# Altium project 724452_RPL-HX_Mobile_AEP_Rev0p91.PrjPcb (part 5 of 13)

## Sheet 0030_DEBUG_CARD_SPI_SIG.SchDoc
size A3
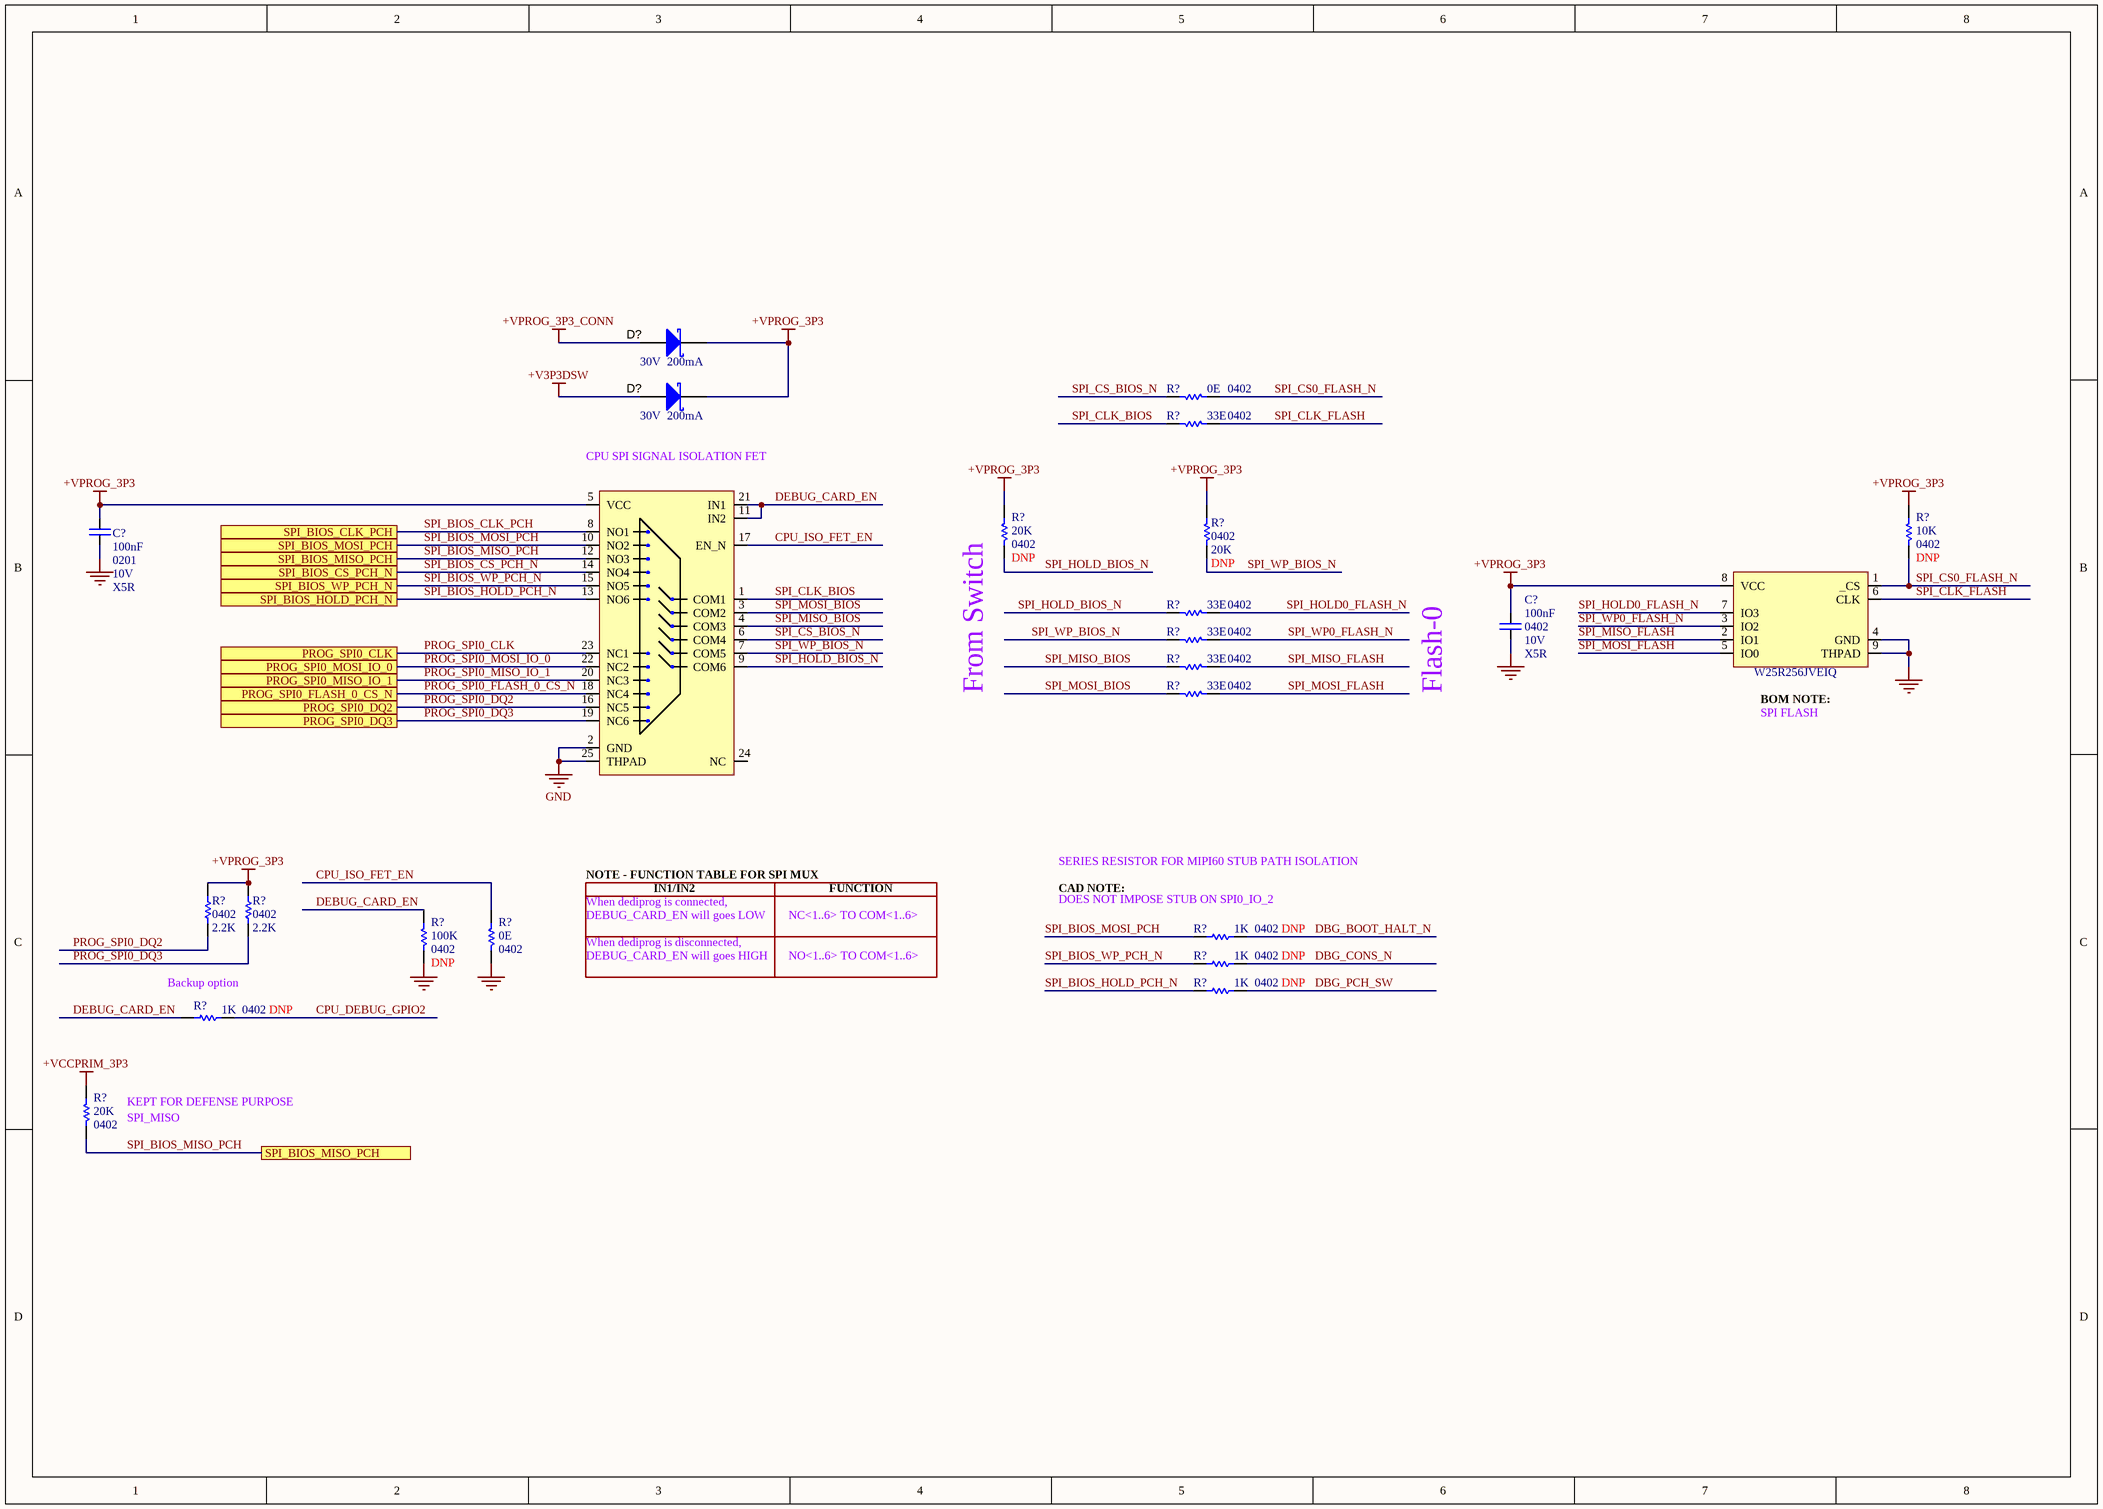
[diagram p52: 0030_DEBUG_CARD_SPI_SIG.SchDoc]

### Parts
(Parts that share a designator on the sheet are numbered #1, #2 ... from top to bottom, then left to right.)
C?#94  value 100nF  Case/Package: 0201  Voltage: 10V  Dielectric: X5R  [CAPC0201]
C?#95  value 100nF  Case/Package: 0402  Voltage: 10V  Dielectric: X5R  [CAPC0402]
D?#1  Current: 200mA  Voltage: 30V  (hidden comment: SCHOTTKY)
D?#2  Current: 200mA  Voltage: 30V  (hidden comment: SCHOTTKY)
EU?#1  C_TS3A27518E  (value not drawn)
EU?#2  Manufacturer Part Number: W25R256JVEIQ  (hidden comment: W25R256JV)
R?#73  value 0E  Case/Package: 0402  [RESC0402]  (hidden comment: Res)
R?#74  value 33E  Case/Package: 0402  [RESC0402]  (hidden comment: Res)
R?#75  value 20K  Case/Package: 0402  [RESC0402]  (hidden comment: Res)
R?#76  value 20K  Case/Package: 0402  [RESC0402]  (hidden comment: Res)
R?#77  value 10K  Case/Package: 0402  [RESC0402]  (hidden comment: Res)
R?#78  value 33E  Case/Package: 0402  [RESC0402]  (hidden comment: Res)
R?#79  value 33E  Case/Package: 0402  [RESC0402]  (hidden comment: Res)
R?#80  value 33E  Case/Package: 0402  [RESC0402]  (hidden comment: Res)
R?#81  value 33E  Case/Package: 0402  [RESC0402]  (hidden comment: Res)
R?#82  value 2.2K  Case/Package: 0402  [RESC0402]  (hidden comment: Res)
R?#83  value 2.2K  Case/Package: 0402  [RESC0402]  (hidden comment: Res)
R?#84  value 100K  Case/Package: 0402  [RESC0402]  (hidden comment: Res)
R?#85  value 0E  Case/Package: 0402  [RESC0402]  (hidden comment: Res)
R?#86  value 1K  Case/Package: 0402  [RESC0402]  (hidden comment: Res)
R?#87  value 1K  Case/Package: 0402  [RESC0402]  (hidden comment: Res)
R?#88  value 1K  Case/Package: 0402  [RESC0402]  (hidden comment: Res)
R?#89  value 1K  Case/Package: 0402  [RESC0402]  (hidden comment: Res)
R?#90  value 20K  Case/Package: 0402  [RESC0402]  (hidden comment: Res)

### Ports
PROG_SPI0_CLK, PROG_SPI0_DQ2, PROG_SPI0_DQ3, PROG_SPI0_FLASH_0_CS_N, PROG_SPI0_MISO_IO_1, PROG_SPI0_MOSI_IO_0, SPI_BIOS_CLK_PCH, SPI_BIOS_CS_PCH_N, SPI_BIOS_HOLD_PCH_N, SPI_BIOS_MISO_PCH, SPI_BIOS_MOSI_PCH, SPI_BIOS_WP_PCH_N

### Nets
+V3P3DSW: D?#2.A
+VCCPRIM_3P3: R?#90.2
+VPROG_3P3: C?#94.1 C?#95.1 D?#1.K D?#2.K EU?#1.5(VCC) EU?#2.8(VCC) R?#75.2 R?#76.2 R?#77.2 R?#82.2 R?#83.2
+VPROG_3P3_CONN: D?#1.A
GND: C?#94.2 C?#95.2 EU?#1.2(GND) EU?#1.25(THPAD) EU?#2.4(GND) EU?#2.9(THPAD) R?#84.1 R?#85.1  [project net EXP_A_RX_4_DP]
CPU_DEBUG_GPIO2: R?#89.1
CPU_ISO_FET_EN: EU?#1.17(EN_N) R?#85.2
DBG_BOOT_HALT_N: R?#86.1
DBG_CONS_N: R?#87.1
DBG_PCH_SW: R?#88.1
DEBUG_CARD_EN: EU?#1.11(IN2) EU?#1.21(IN1) R?#84.2 R?#89.2
PROG_SPI0_CLK: EU?#1.23(NC1) ; port PROG_SPI0_CLK
PROG_SPI0_DQ2: EU?#1.16(NC5) R?#82.1 ; port PROG_SPI0_DQ2
PROG_SPI0_DQ3: EU?#1.19(NC6) R?#83.1 ; port PROG_SPI0_DQ3
PROG_SPI0_FLASH_0_CS_N: EU?#1.18(NC4) ; port PROG_SPI0_FLASH_0_CS_N
PROG_SPI0_MISO_IO_1: EU?#1.20(NC3) ; port PROG_SPI0_MISO_IO_1
PROG_SPI0_MOSI_IO_0: EU?#1.22(NC2) ; port PROG_SPI0_MOSI_IO_0
SPI_BIOS_CLK_PCH: EU?#1.8(NO1) ; port SPI_BIOS_CLK_PCH
SPI_BIOS_CS_PCH_N: EU?#1.14(NO4) ; port SPI_BIOS_CS_PCH_N
SPI_BIOS_HOLD_PCH_N: EU?#1.13(NO6) R?#88.2 ; port SPI_BIOS_HOLD_PCH_N
SPI_BIOS_MISO_PCH: EU?#1.12(NO3) R?#90.1 ; port SPI_BIOS_MISO_PCH
SPI_BIOS_MOSI_PCH: EU?#1.10(NO2) R?#86.2 ; port SPI_BIOS_MOSI_PCH
SPI_BIOS_WP_PCH_N: EU?#1.15(NO5) R?#87.2 ; port SPI_BIOS_WP_PCH_N
SPI_CLK_BIOS: EU?#1.1(COM1) R?#74.1
SPI_CLK_FLASH: EU?#2.6(CLK) R?#74.2
SPI_CS0_FLASH_N: EU?#2.1(_CS) R?#73.2 R?#77.1
SPI_CS_BIOS_N: EU?#1.6(COM4) R?#73.1
SPI_HOLD0_FLASH_N: EU?#2.7(IO3) R?#78.2
SPI_HOLD_BIOS_N: EU?#1.9(COM6) R?#75.1 R?#78.1
SPI_MISO_BIOS: EU?#1.4(COM3) R?#80.1
SPI_MISO_FLASH: EU?#2.2(IO1) R?#80.2
SPI_MOSI_BIOS: EU?#1.3(COM2) R?#81.1
SPI_MOSI_FLASH: EU?#2.5(IO0) R?#81.2
SPI_WP0_FLASH_N: EU?#2.3(IO2) R?#79.2
SPI_WP_BIOS_N: EU?#1.7(COM5) R?#76.1 R?#79.1

Not connected (* = marked no-connect by the designer): EU?#1 24(NC)

### Notes on the sheet
- CPU SPI SIGNAL ISOLATION FET
- (near R?#75) From Switch
- Flash-0
- (near EU?#2) BOM NOTE:
- SPI FLASH
- DEBUG_CARD_EN will goes LOW
- When dediprog is connected,
- NOTE - FUNCTION TABLE FOR SPI MUX
- IN1/IN2
- NC<1..6> TO COM<1..6>
- FUNCTION
- CAD NOTE:
- (near R?#86) DOES NOT IMPOSE STUB ON SPI0_IO_2
- SERIES RESISTOR FOR MIPI60 STUB PATH ISOLATION
- (near R?#89) Backup option
- DEBUG_CARD_EN will goes HIGH
- When dediprog is disconnected,
- NO<1..6> TO COM<1..6>
- (near R?#90) KEPT FOR DEFENSE PURPOSE
- (near R?#90) SPI_MISO

### Library data of the parts
C?#94 = Cap: CAP CER 100nF 10V X5R 0201
C?#95 = Cap: CAP CER 100nF 10V X5R 0402
D?#1 D?#2 = SCHOTTKY: Diode, Schottky, 30V, 200mA,; ComponentLink1Description: Datasheet link; ComponentLink1URL: http://www.comchip.com.tw/cms/UserFiles/QW-BB012%20CDBC520-G%7E5100-G%20RevC809622.pdf; Manufacturer Part Number: *; Case/Package: *
EU?#1 = C_TS3A27518E: 6 Circuit IC Switch 2:1 6.2Ohm 24-WQFN (4x4); Manufacturer Part Number: TS3A27518ERTWR; Case/Package: 24-WFQFN
EU?#2 = W25R256JV: FLASH - NOR Memory IC 256Mb (32M x 8) SPI - Quad I/O 133 MHz 7 ns 8-WSON (8x6); Case/Package: 8-WSON
R?#73 R?#85 = Res: Thick Film Resistor -  0ohm, 1%, 0402
R?#74 R?#78-R?#81 = Res: Thick Film Resistor -  33ohm, 1%, 0402
R?#75 R?#76 R?#90 = Res: Thick Film Resistor -  20Kohm, 1%, 0402
  R?#75 R?#76: DNP: DNP
R?#77 = Res: Thick Film Resistor -  10Kohm, 1%, 0402; DNP: DNP
R?#82 R?#83 = Res: Thick Film Resistor -  2.2Kohm, 1%, 0402
R?#84 = Res: Thick Film Resistor -  100Kohm, 1%, 0402; DNP: DNP
R?#86-R?#89 = Res: Thick Film Resistor -  1Kohm, 1%, 0402; DNP: DNP

## Sheet 0031_DEBUG-XDP_SERIES_T.SchDoc
size A3
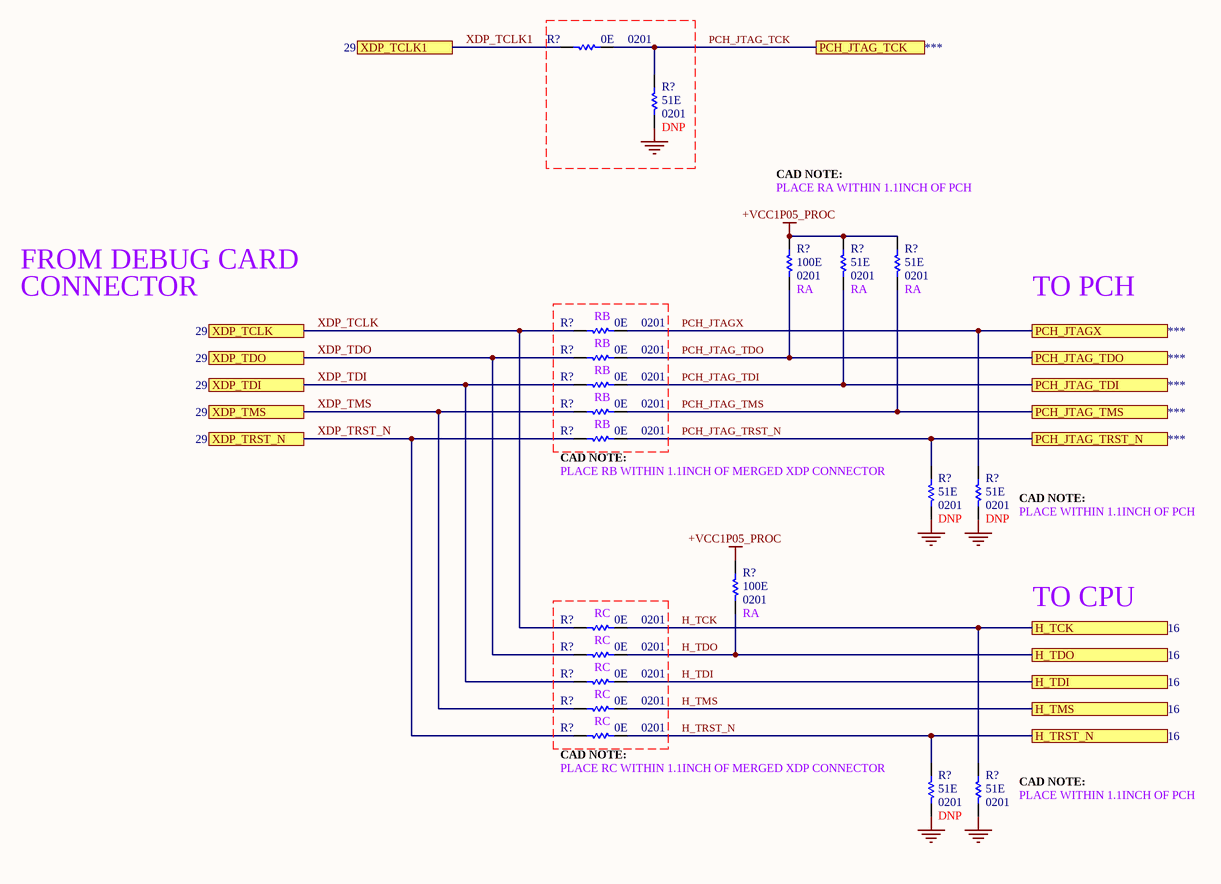
[diagram p53: 0031_DEBUG-XDP_SERIES_T.SchDoc]

### Parts
(Parts that share a designator on the sheet are numbered #1, #2 ... from top to bottom, then left to right.)
R?#91  value 0E  Case/Package: 0201  [RESC0201]  (hidden comment: Res)
R?#92  value 51E  Case/Package: 0201  [RESC0201]  (hidden comment: Res)
R?#93  value 100E  Case/Package: 0201  [RESC0201]  (hidden comment: Res)
R?#94  value 51E  Case/Package: 0201  [RESC0201]  (hidden comment: Res)
R?#95  value 51E  Case/Package: 0201  [RESC0201]  (hidden comment: Res)
R?#96  value 0E  Case/Package: 0201  [RESC0201]  (hidden comment: Res)
R?#97  value 0E  Case/Package: 0201  [RESC0201]  (hidden comment: Res)
R?#98  value 0E  Case/Package: 0201  [RESC0201]  (hidden comment: Res)
R?#99  value 0E  Case/Package: 0201  [RESC0201]  (hidden comment: Res)
R?#100  value 0E  Case/Package: 0201  [RESC0201]  (hidden comment: Res)
R?#101  value 51E  Case/Package: 0201  [RESC0201]  (hidden comment: Res)
R?#102  value 51E  Case/Package: 0201  [RESC0201]  (hidden comment: Res)
R?#103  value 100E  Case/Package: 0201  [RESC0201]  (hidden comment: Res)
R?#104  value 0E  Case/Package: 0201  [RESC0201]  (hidden comment: Res)
R?#105  value 0E  Case/Package: 0201  [RESC0201]  (hidden comment: Res)
R?#106  value 0E  Case/Package: 0201  [RESC0201]  (hidden comment: Res)
R?#107  value 0E  Case/Package: 0201  [RESC0201]  (hidden comment: Res)
R?#108  value 0E  Case/Package: 0201  [RESC0201]  (hidden comment: Res)
R?#109  value 51E  Case/Package: 0201  [RESC0201]  (hidden comment: Res)
R?#110  value 51E  Case/Package: 0201  [RESC0201]  (hidden comment: Res)

### Ports
H_TCK, H_TDI, H_TDO, H_TMS, H_TRST_N, PCH_JTAG_TCK, PCH_JTAG_TDI, PCH_JTAG_TDO, PCH_JTAG_TMS, PCH_JTAG_TRST_N, PCH_JTAGX, XDP_TCLK, XDP_TCLK1, XDP_TDI, XDP_TDO, XDP_TMS, XDP_TRST_N

### Nets
+VCC1P05_PROC: R?#93.2 R?#94.2 R?#95.2 R?#103.2
GND: R?#92.1 R?#101.1 R?#102.1 R?#109.1 R?#110.1  [project net EXP_A_RX_4_DP]
H_TCK: R?#104.2 R?#110.2 ; port H_TCK
H_TDI: R?#106.2 ; port H_TDI
H_TDO: R?#103.1 R?#105.2 ; port H_TDO
H_TMS: R?#107.2 ; port H_TMS
H_TRST_N: R?#108.2 R?#109.2 ; port H_TRST_N
PCH_JTAG_TCK: R?#91.2 R?#92.2 ; port PCH_JTAG_TCK
PCH_JTAG_TDI: R?#94.1 R?#98.2 ; port PCH_JTAG_TDI
PCH_JTAG_TDO: R?#93.1 R?#97.2 ; port PCH_JTAG_TDO
PCH_JTAG_TMS: R?#95.1 R?#99.2 ; port PCH_JTAG_TMS
PCH_JTAG_TRST_N: R?#100.2 R?#101.2 ; port PCH_JTAG_TRST_N
PCH_JTAGX: R?#96.2 R?#102.2 ; port PCH_JTAGX
XDP_TCLK: R?#96.1 R?#104.1 ; port XDP_TCLK
XDP_TCLK1: R?#91.1 ; port XDP_TCLK1
XDP_TDI: R?#98.1 R?#106.1 ; port XDP_TDI
XDP_TDO: R?#97.1 R?#105.1 ; port XDP_TDO
XDP_TMS: R?#99.1 R?#107.1 ; port XDP_TMS
XDP_TRST_N: R?#100.1 R?#108.1 ; port XDP_TRST_N

### Notes on the sheet
- CAD NOTE:
- PLACE RA WITHIN 1.1INCH OF PCH
- FROM DEBUG CARD
- CONNECTOR
- (near R?#96) RB
- (near R?#93) RA
- (near R?#94) RA
- (near R?#95) RA
- TO PCH
- (near R?#97) RB
- (near R?#98) RB
- (near R?#100) CAD NOTE:
- (near R?#100) PLACE RB WITHIN 1.1INCH OF MERGED XDP CONNECTOR
- (near R?#99) RB
- (near R?#102) CAD NOTE:
- (near R?#102) PLACE WITHIN 1.1INCH OF PCH
- (near R?#104) RC
- (near R?#103) RA
- TO CPU
- (near R?#105) RC
- (near R?#108) CAD NOTE:
- (near R?#106) RC
- (near R?#107) RC
- (near R?#108) PLACE RC WITHIN 1.1INCH OF MERGED XDP CONNECTOR
- (near R?#110) CAD NOTE:
- (near R?#110) PLACE WITHIN 1.1INCH OF PCH

### Library data of the parts
R?#91 R?#96-R?#100 R?#104-R?#108 = Res: Thick Film Resistor -  0ohm, 1%, 0201
R?#92 R?#94 R?#95 R?#101 R?#102 R?#109 R?#110 = Res: Thick Film Resistor -  51ohm, 1%, 0201
  R?#92 R?#101 R?#102 R?#109: DNP: DNP
R?#93 R?#103 = Res: Thick Film Resistor -  100ohm, 1%, 0201

## Sheet 0032_DEGUG-JTAG.SchDoc
size A3
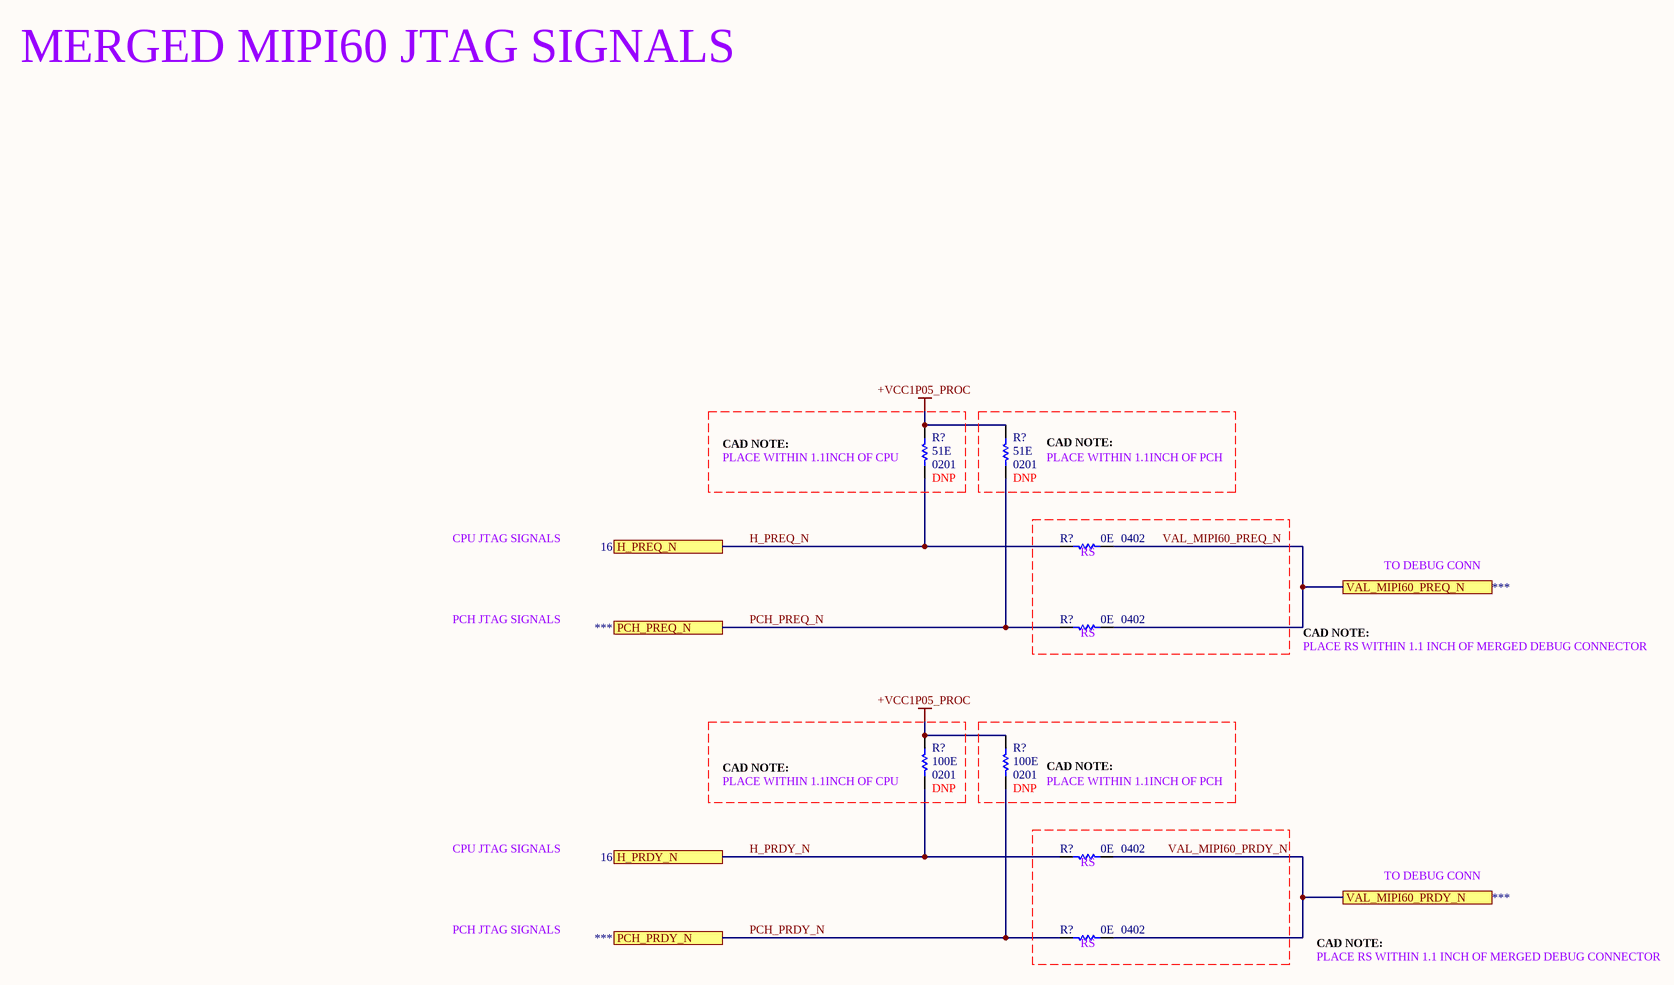
[diagram p54: 0032_DEGUG-JTAG.SchDoc]

### Parts
(Parts that share a designator on the sheet are numbered #1, #2 ... from top to bottom, then left to right.)
R?#111  value 51E  Case/Package: 0201  [RESC0201]  (hidden comment: Res)
R?#112  value 51E  Case/Package: 0201  [RESC0201]  (hidden comment: Res)
R?#113  value 0E  Case/Package: 0402  [RESC0402]  (hidden comment: Res)
R?#114  value 0E  Case/Package: 0402  [RESC0402]  (hidden comment: Res)
R?#115  value 100E  Case/Package: 0201  [RESC0201]  (hidden comment: Res)
R?#116  value 100E  Case/Package: 0201  [RESC0201]  (hidden comment: Res)
R?#117  value 0E  Case/Package: 0402  [RESC0402]  (hidden comment: Res)
R?#118  value 0E  Case/Package: 0402  [RESC0402]  (hidden comment: Res)

### Ports
H_PRDY_N, H_PREQ_N, PCH_PRDY_N, PCH_PREQ_N, VAL_MIPI60_PRDY_N, VAL_MIPI60_PREQ_N

### Nets
+VCC1P05_PROC: R?#111.2 R?#112.2 R?#115.2 R?#116.2
H_PRDY_N: R?#115.1 R?#117.1 ; port H_PRDY_N
H_PREQ_N: R?#111.1 R?#113.1 ; port H_PREQ_N
PCH_PRDY_N: R?#116.1 R?#118.1 ; port PCH_PRDY_N
PCH_PREQ_N: R?#112.1 R?#114.1 ; port PCH_PREQ_N
VAL_MIPI60_PRDY_N: R?#117.2 R?#118.2 ; port VAL_MIPI60_PRDY_N
VAL_MIPI60_PREQ_N: R?#113.2 R?#114.2 ; port VAL_MIPI60_PREQ_N

### Notes on the sheet
- MERGED MIPI60 JTAG SIGNALS
- CAD NOTE:
- (near R?#111) PLACE WITHIN 1.1INCH OF CPU
- (near R?#112) CAD NOTE:
- (near R?#112) PLACE WITHIN 1.1INCH OF PCH
- CPU JTAG SIGNALS
- (near R?#113) RS
- PCH JTAG SIGNALS
- TO DEBUG CONN
- (near R?#114) RS
- PLACE RS WITHIN 1.1 INCH OF MERGED DEBUG CONNECTOR
- (near R?#115) PLACE WITHIN 1.1INCH OF CPU
- (near R?#116) CAD NOTE:
- (near R?#116) PLACE WITHIN 1.1INCH OF PCH
- (near R?#117) RS
- (near R?#118) RS

### Library data of the parts
R?#111 R?#112 = Res: Thick Film Resistor -  51ohm, 1%, 0201; DNP: DNP
R?#113 R?#114 R?#117 R?#118 = Res: Thick Film Resistor -  0ohm, 1%, 0402
R?#115 R?#116 = Res: Thick Film Resistor -  100ohm, 1%, 0201; DNP: DNP

## Sheet 0034_PCH_CLOCK.SchDoc
size A3
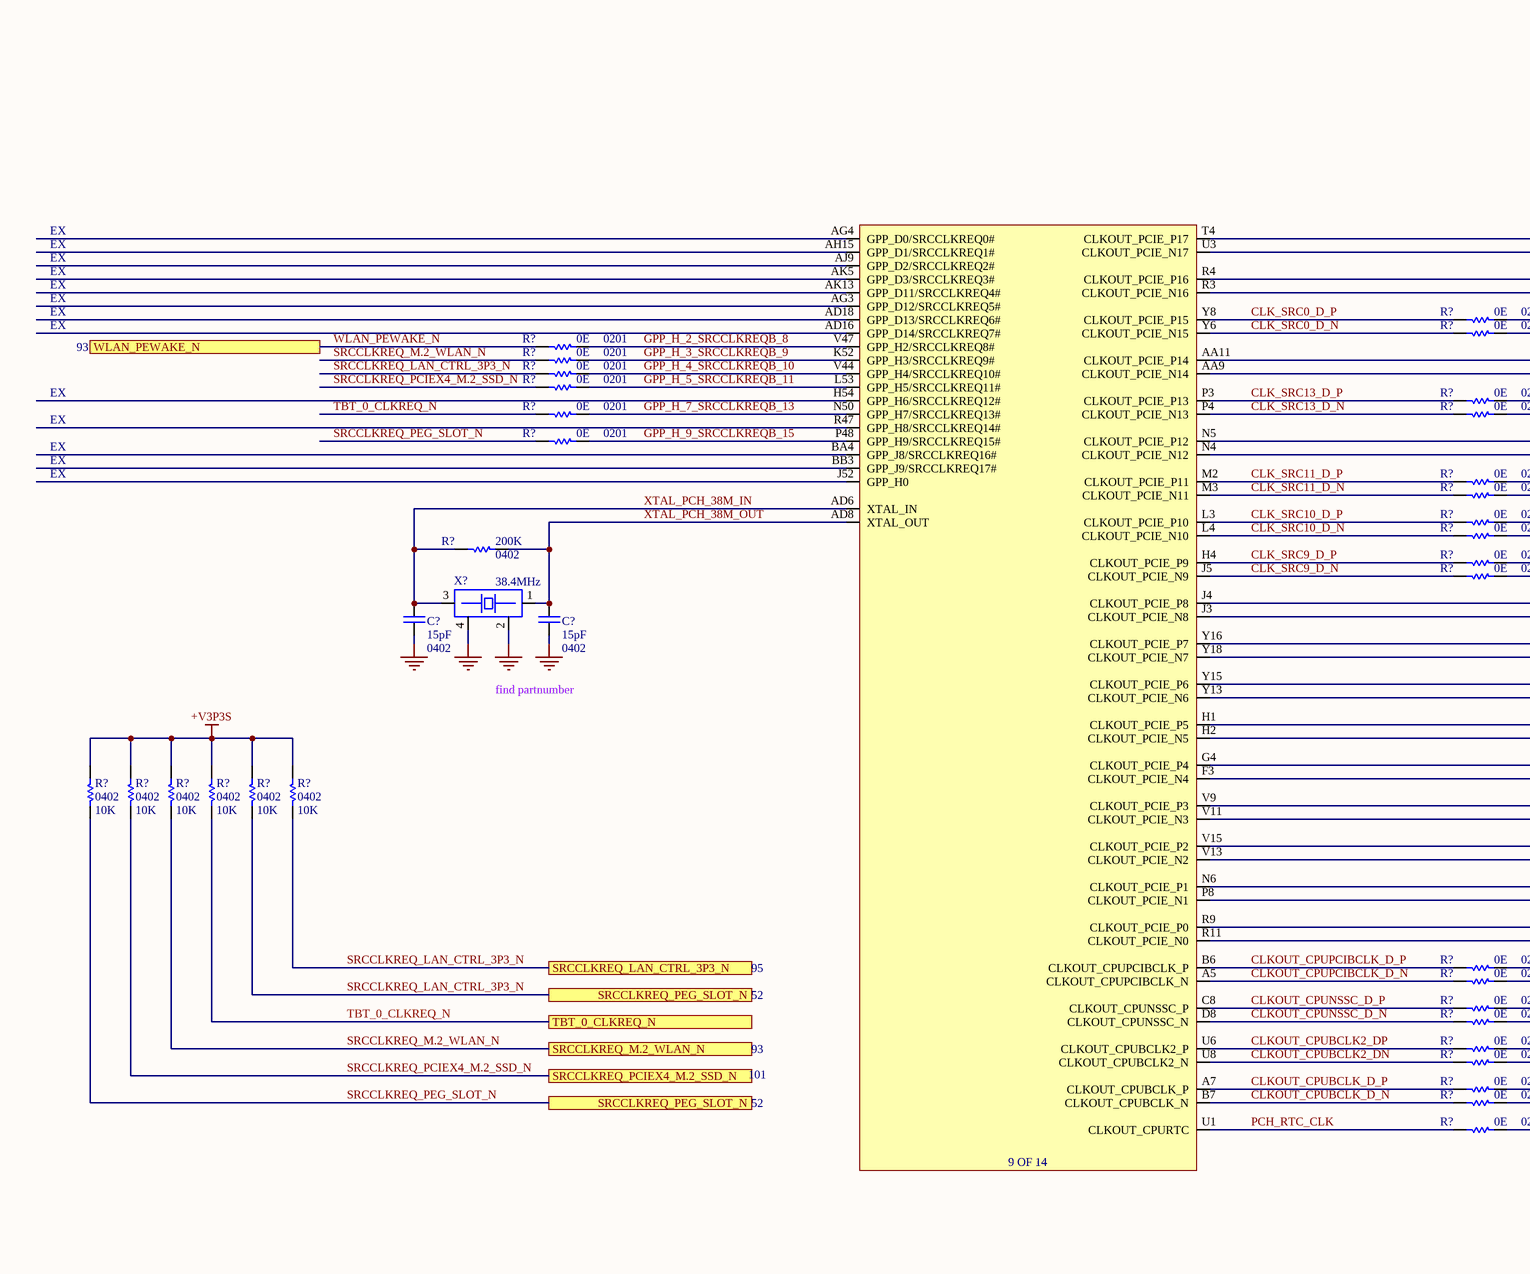
[diagram p55: 0034_PCH_CLOCK.SchDoc, bottom left]
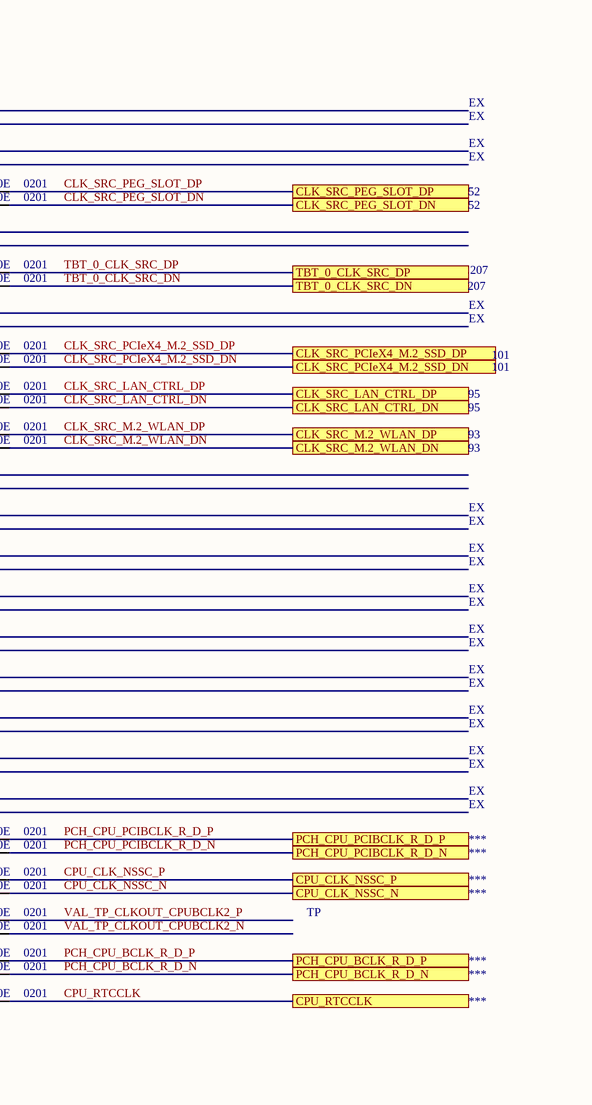
[diagram p56: 0034_PCH_CLOCK.SchDoc, bottom middle]

### Parts
(Parts that share a designator on the sheet are numbered #1, #2 ... from top to bottom, then left to right.)
C?#96  value 15pF  Case/Package: 0402  [CAPC0402]  (hidden comment: Cap)
C?#97  value 15pF  Case/Package: 0402  [CAPC0402]  (hidden comment: Cap)
R?#119  value 0E  Case/Package: 0201  [RESC0201]  (hidden comment: Res)
R?#120  value 0E  Case/Package: 0201  [RESC0201]  (hidden comment: Res)
R?#121  value 0E  Case/Package: 0201  [RESC0201]  (hidden comment: Res)
R?#122  value 0E  Case/Package: 0201  [RESC0201]  (hidden comment: Res)
R?#123  value 0E  Case/Package: 0201  [RESC0201]  (hidden comment: Res)
R?#124  value 0E  Case/Package: 0201  [RESC0201]  (hidden comment: Res)
R?#125  value 0E  Case/Package: 0201  [RESC0201]  (hidden comment: Res)
R?#126  value 0E  Case/Package: 0201  [RESC0201]  (hidden comment: Res)
R?#127  value 0E  Case/Package: 0201  [RESC0201]  (hidden comment: Res)
R?#128  value 0E  Case/Package: 0201  [RESC0201]  (hidden comment: Res)
R?#129  value 0E  Case/Package: 0201  [RESC0201]  (hidden comment: Res)
R?#130  value 0E  Case/Package: 0201  [RESC0201]  (hidden comment: Res)
R?#131  value 0E  Case/Package: 0201  [RESC0201]  (hidden comment: Res)
R?#132  value 0E  Case/Package: 0201  [RESC0201]  (hidden comment: Res)
R?#133  value 200K  Case/Package: 0402  [RESC0402]  (hidden comment: Res)
R?#134  value 0E  Case/Package: 0201  [RESC0201]  (hidden comment: Res)
R?#135  value 0E  Case/Package: 0201  [RESC0201]  (hidden comment: Res)
R?#136  value 10K  Case/Package: 0402  [RESC0402]  (hidden comment: Res)
R?#137  value 10K  Case/Package: 0402  [RESC0402]  (hidden comment: Res)
R?#138  value 10K  Case/Package: 0402  [RESC0402]  (hidden comment: Res)
R?#139  value 10K  Case/Package: 0402  [RESC0402]  (hidden comment: Res)
R?#140  value 10K  Case/Package: 0402  [RESC0402]  (hidden comment: Res)
R?#141  value 10K  Case/Package: 0402  [RESC0402]  (hidden comment: Res)
R?#142  value 0E  Case/Package: 0201  [RESC0201]  (hidden comment: Res)
R?#143  value 0E  Case/Package: 0201  [RESC0201]  (hidden comment: Res)
R?#144  value 0E  Case/Package: 0201  [RESC0201]  (hidden comment: Res)
R?#145  value 0E  Case/Package: 0201  [RESC0201]  (hidden comment: Res)
R?#146  value 0E  Case/Package: 0201  [RESC0201]  (hidden comment: Res)
R?#147  value 0E  Case/Package: 0201  [RESC0201]  (hidden comment: Res)
R?#148  value 0E  Case/Package: 0201  [RESC0201]  (hidden comment: Res)
R?#149  value 0E  Case/Package: 0201  [RESC0201]  (hidden comment: Res)
R?#150  value 0E  Case/Package: 0201  [RESC0201]  (hidden comment: Res)
U?#3  C_RPL_S_PCH_EXT  (value not drawn)  (part I of 14)
X?#1  value 38.4MHz  [Crystal_3225]  (hidden comment: C389863)

### Ports
CLK_SRC_LAN_CTRL_DN, CLK_SRC_LAN_CTRL_DP, CLK_SRC_M.2_WLAN_DN, CLK_SRC_M.2_WLAN_DP, CLK_SRC_PCIeX4_M.2_SSD_DN, CLK_SRC_PCIeX4_M.2_SSD_DP, CLK_SRC_PEG_SLOT_DN, CLK_SRC_PEG_SLOT_DP, CPU_CLK_NSSC_N, CPU_CLK_NSSC_P, CPU_RTCCLK, PCH_CPU_BCLK_R_D_N, PCH_CPU_BCLK_R_D_P, PCH_CPU_PCIBCLK_R_D_N, PCH_CPU_PCIBCLK_R_D_P, SRCCLKREQ_LAN_CTRL_3P3_N, SRCCLKREQ_M.2_WLAN_N, SRCCLKREQ_PCIEX4_M.2_SSD_N, SRCCLKREQ_PEG_SLOT_N, TBT_0_CLK_SRC_DN, TBT_0_CLK_SRC_DP, TBT_0_CLKREQ_N, WLAN_PEWAKE_N

### Nets
+V3P3S: R?#136.2 R?#137.2 R?#138.2 R?#139.2 R?#140.2 R?#141.2
GND: C?#96.1 C?#97.1 X?#1.2 X?#1.4  [project net EXP_A_RX_4_DP]
CLK_SRC0_D_N: R?#120.1 U?#3.Y6(CLKOUT_PCIE_N15)
CLK_SRC0_D_P: R?#119.1 U?#3.Y8(CLKOUT_PCIE_P15)
CLK_SRC9_D_N: R?#135.1 U?#3.J5(CLKOUT_PCIE_N9)
CLK_SRC9_D_P: R?#134.1 U?#3.H4(CLKOUT_PCIE_P9)
CLK_SRC10_D_N: R?#132.1 U?#3.L4(CLKOUT_PCIE_N10)
CLK_SRC10_D_P: R?#131.1 U?#3.L3(CLKOUT_PCIE_P10)
CLK_SRC11_D_N: R?#130.1 U?#3.M3(CLKOUT_PCIE_N11)
CLK_SRC11_D_P: R?#129.1 U?#3.M2(CLKOUT_PCIE_P11)
CLK_SRC13_D_N: R?#127.1 U?#3.P4(CLKOUT_PCIE_N13)
CLK_SRC13_D_P: R?#125.1 U?#3.P3(CLKOUT_PCIE_P13)
CLK_SRC_LAN_CTRL_DN: R?#132.2 ; port CLK_SRC_LAN_CTRL_DN
CLK_SRC_LAN_CTRL_DP: R?#131.2 ; port CLK_SRC_LAN_CTRL_DP
CLK_SRC_M.2_WLAN_DN: R?#135.2 ; port CLK_SRC_M.2_WLAN_DN
CLK_SRC_M.2_WLAN_DP: R?#134.2 ; port CLK_SRC_M.2_WLAN_DP
CLK_SRC_PCIeX4_M.2_SSD_DN: R?#130.2 ; port CLK_SRC_PCIeX4_M.2_SSD_DN
CLK_SRC_PCIeX4_M.2_SSD_DP: R?#129.2 ; port CLK_SRC_PCIeX4_M.2_SSD_DP
CLK_SRC_PEG_SLOT_DN: R?#120.2 ; port CLK_SRC_PEG_SLOT_DN
CLK_SRC_PEG_SLOT_DP: R?#119.2 ; port CLK_SRC_PEG_SLOT_DP
CLKOUT_CPUBCLK2_DN: R?#147.1 U?#3.U8(CLKOUT_CPUBCLK2_N)
CLKOUT_CPUBCLK2_DP: R?#146.1 U?#3.U6(CLKOUT_CPUBCLK2_P)
CLKOUT_CPUBCLK_D_N: R?#149.1 U?#3.B7(CLKOUT_CPUBCLK_N)
CLKOUT_CPUBCLK_D_P: R?#148.1 U?#3.A7(CLKOUT_CPUBCLK_P)
CLKOUT_CPUNSSC_D_N: R?#145.1 U?#3.D8(CLKOUT_CPUNSSC_N)
CLKOUT_CPUNSSC_D_P: R?#144.1 U?#3.C8(CLKOUT_CPUNSSC_P)
CLKOUT_CPUPCIBCLK_D_N: R?#143.1 U?#3.A5(CLKOUT_CPUPCIBCLK_N)
CLKOUT_CPUPCIBCLK_D_P: R?#142.1 U?#3.B6(CLKOUT_CPUPCIBCLK_P)
CPU_CLK_NSSC_N: R?#145.2 ; port CPU_CLK_NSSC_N
CPU_CLK_NSSC_P: R?#144.2 ; port CPU_CLK_NSSC_P
CPU_RTCCLK: R?#150.2 ; port CPU_RTCCLK
GPP_H_2_SRCCLKREQB_8: R?#121.2 U?#3.V47(GPP_H2/SRCCLKREQ8#)
GPP_H_3_SRCCLKREQB_9: R?#122.2 U?#3.K52(GPP_H3/SRCCLKREQ9#)
GPP_H_4_SRCCLKREQB_10: R?#123.2 U?#3.V44(GPP_H4/SRCCLKREQ10#)
GPP_H_5_SRCCLKREQB_11: R?#124.2 U?#3.L53(GPP_H5/SRCCLKREQ11#)
GPP_H_7_SRCCLKREQB_13: R?#126.2 U?#3.N50(GPP_H7/SRCCLKREQ13#)
GPP_H_9_SRCCLKREQB_15: R?#128.2 U?#3.P48(GPP_H9/SRCCLKREQ15#)
PCH_CPU_BCLK_R_D_N: R?#149.2 ; port PCH_CPU_BCLK_R_D_N
PCH_CPU_BCLK_R_D_P: R?#148.2 ; port PCH_CPU_BCLK_R_D_P
PCH_CPU_PCIBCLK_R_D_N: R?#143.2 ; port PCH_CPU_PCIBCLK_R_D_N
PCH_CPU_PCIBCLK_R_D_P: R?#142.2 ; port PCH_CPU_PCIBCLK_R_D_P
PCH_RTC_CLK: R?#150.1 U?#3.U1(CLKOUT_CPURTC)
SRCCLKREQ_LAN_CTRL_3P3_N: R?#123.1 R?#128.1 R?#136.1 R?#140.1 R?#141.1 ; port SRCCLKREQ_PEG_SLOT_N, port SRCCLKREQ_LAN_CTRL_3P3_N  [also labelled SRCCLKREQ_PEG_SLOT_N]  [project net PCIEX16_PRSNT2_N]
SRCCLKREQ_M.2_WLAN_N: R?#122.1 R?#138.1 ; port SRCCLKREQ_M.2_WLAN_N
SRCCLKREQ_PCIEX4_M.2_SSD_N: R?#124.1 R?#137.1 ; port SRCCLKREQ_PCIEX4_M.2_SSD_N
TBT_0_CLK_SRC_DN: R?#127.2 ; port TBT_0_CLK_SRC_DN
TBT_0_CLK_SRC_DP: R?#125.2 ; port TBT_0_CLK_SRC_DP
TBT_0_CLKREQ_N: R?#126.1 R?#139.1 ; port TBT_0_CLKREQ_N
VAL_TP_CLKOUT_CPUBCLK2_N: R?#147.2
VAL_TP_CLKOUT_CPUBCLK2_P: R?#146.2
WLAN_PEWAKE_N: R?#121.1 ; port WLAN_PEWAKE_N
XTAL_PCH_38M_IN: C?#96.2 R?#133.2 U?#3.AD6(XTAL_IN) X?#1.3
XTAL_PCH_38M_OUT: C?#97.2 R?#133.1 U?#3.AD8(XTAL_OUT) X?#1.1

Not connected (* = marked no-connect by the designer): U?#3 AA9(CLKOUT_PCIE_N14) AA11(CLKOUT_PCIE_P14) AD16(GPP_D14/SRCCLKREQ7#) AD18(GPP_D13/SRCCLKREQ6#) AG3(GPP_D12/SRCCLKREQ5#) AG4(GPP_D0/SRCCLKREQ0#) AH15(GPP_D1/SRCCLKREQ1#) AJ9(GPP_D2/SRCCLKREQ2#) AK5(GPP_D3/SRCCLKREQ3#) AK13(GPP_D11/SRCCLKREQ4#) BA4(GPP_J8/SRCCLKREQ16#) BB3(GPP_J9/SRCCLKREQ17#) F3(CLKOUT_PCIE_N4) G4(CLKOUT_PCIE_P4) H1(CLKOUT_PCIE_P5) H2(CLKOUT_PCIE_N5) H54(GPP_H6/SRCCLKREQ12#) J3(CLKOUT_PCIE_N8) J4(CLKOUT_PCIE_P8) J52(GPP_H0) N4(CLKOUT_PCIE_N12) N5(CLKOUT_PCIE_P12) N6(CLKOUT_PCIE_P1) P8(CLKOUT_PCIE_N1) R3(CLKOUT_PCIE_N16) R4(CLKOUT_PCIE_P16) R9(CLKOUT_PCIE_P0) R11(CLKOUT_PCIE_N0) R47(GPP_H8/SRCCLKREQ14#) T4(CLKOUT_PCIE_P17) U3(CLKOUT_PCIE_N17) V9(CLKOUT_PCIE_P3) V11(CLKOUT_PCIE_N3) V13(CLKOUT_PCIE_N2) V15(CLKOUT_PCIE_P2) Y13(CLKOUT_PCIE_N6) Y15(CLKOUT_PCIE_P6) Y16(CLKOUT_PCIE_P7) Y18(CLKOUT_PCIE_N7)

### Notes on the sheet
- EX
- find partnumber
- TP
- (in symbol C_RPL_S_PCH_EXT, part I) 9 OF 14

### Library data of the parts
C?#96 C?#97 = Cap: CAP CER 15PF 50V NPO 0402; Manufacturer Part Number: CC0402GRNPO9BN240
R?#119-R?#132 R?#134 R?#135 R?#142-R?#150 = Res: Thick Film Resistor -  0ohm, 1%, 0201
R?#133 = Res: Thick Film Resistor -  200Kohm, 1%, 0402
R?#136-R?#141 = Res: Thick Film Resistor -  10Kohm, 1%, 0402
X?#1 = CRYSTAL_1: 38.4MHz ±20ppm Crystal 6.5pF SMD3225; ComponentLink1URL: https://www.verical.com/server-webapp/html/getDatasheet?partID=757227&src-supplier=Verical; ComponentLink1Description: https://www.verical.com/server-webapp/html/getDatasheet?partID=757227&src-supplier=Verical; ComponentLink2URL: http://www.txccrystal.com/images/pdf/7m-accuracy.pdf?src-supplier=Digi-Key; ComponentLink2Description: http://www.txccrystal.com/images/pdf/7m-accuracy.pdf?src-supplier=Digi-Key; ComponentLink3URL: http://www.farnell.com/datasheets/1794111.pdf?src-supplier=Element14; ComponentLink3Description: http://www.farnell.com/datasheets/1794111.pdf?src-supplier=Element14; ComponentLink4URL: http://www.mouser.com/ds/2/417/7m-11184.pdf?src-supplier=Mouser; ComponentLink4Description: http://www.mouser.com/ds/2/417/7m-11184.pdf?src-supplier=Mouser; Case/Package: 3225; Load Capacitance: 6.5pF; ComponentLink5URL: http://www.ecsxtal.com/store/pdf/ecx-32.pdf?src-supplier=Digi-Key; ComponentLink5Description: http://www.ecsxtal.com/store/pdf/ecx-32.pdf?src-supplier=Digi-Key
U?#3 = C_RPL_S_PCH_EXT: Manufacturer Part Number: *; Case/Package: *

## Sheet 0035_PCH H CLOCK OPTION.SchDoc
size A3

## Sheet 0036_PCH_DMI.SchDoc
size 848 x 558 mm
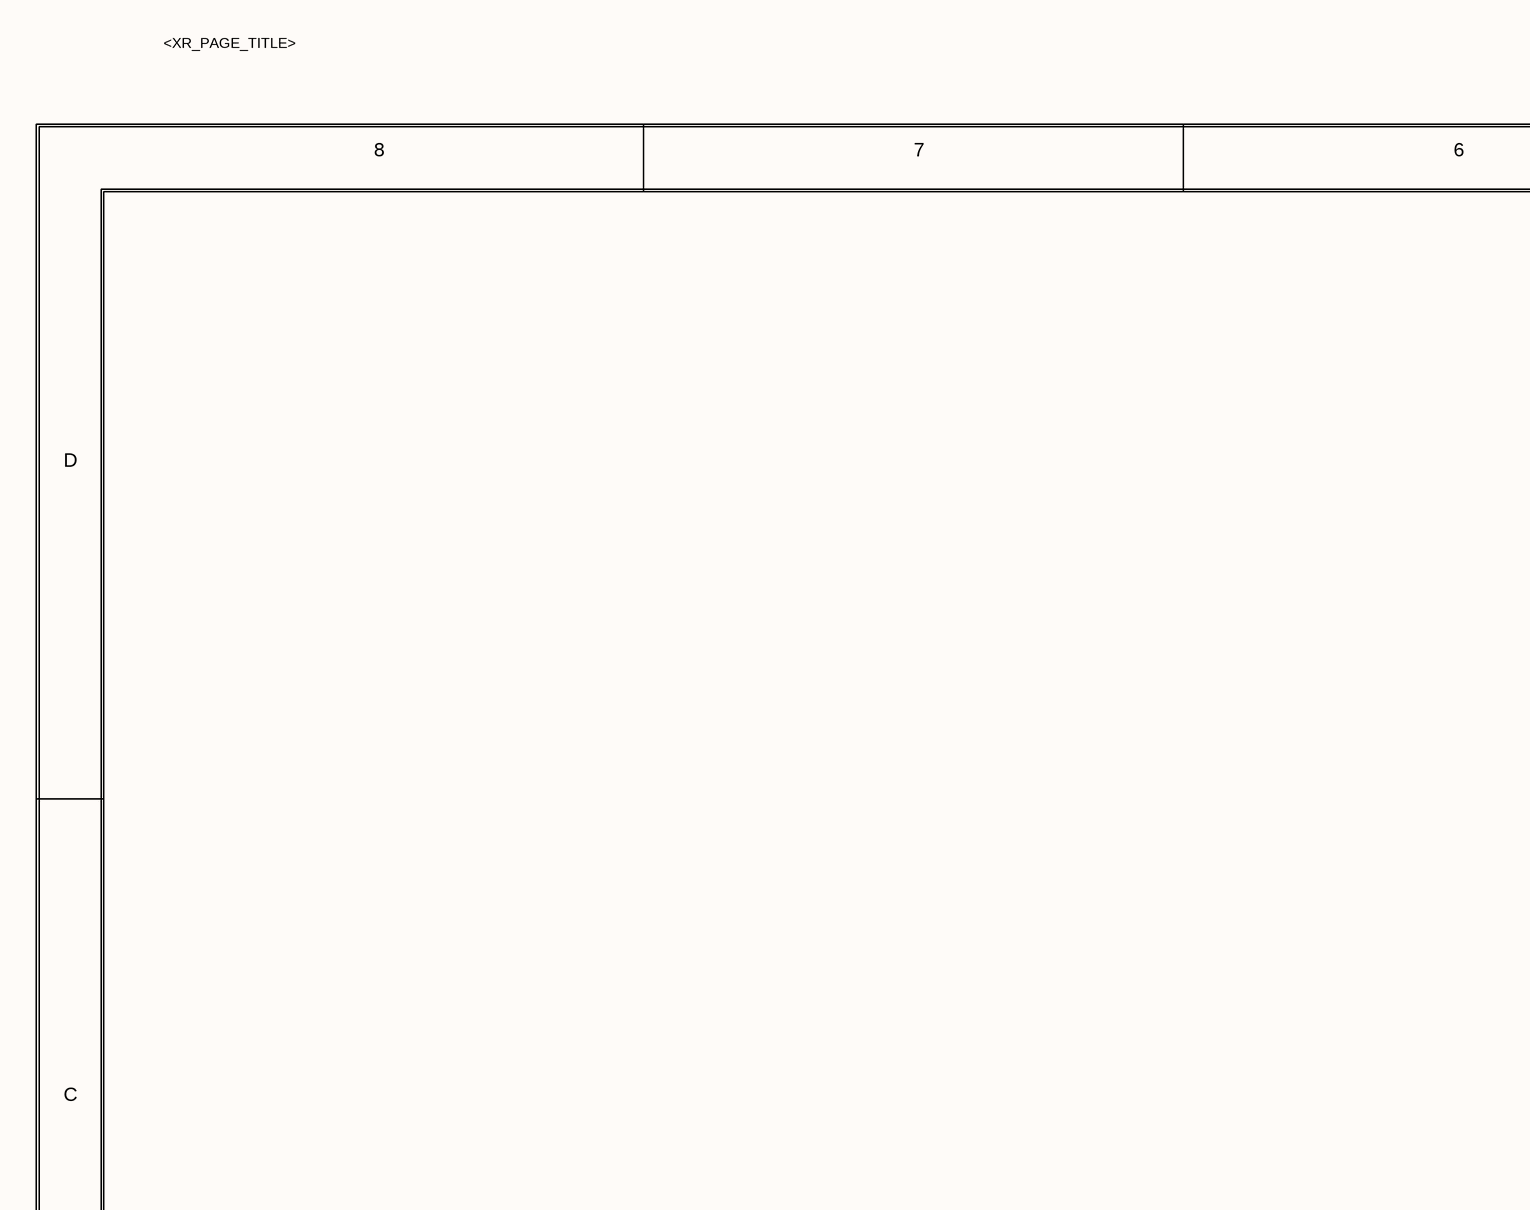
[diagram p57: 0036_PCH_DMI.SchDoc, top left]
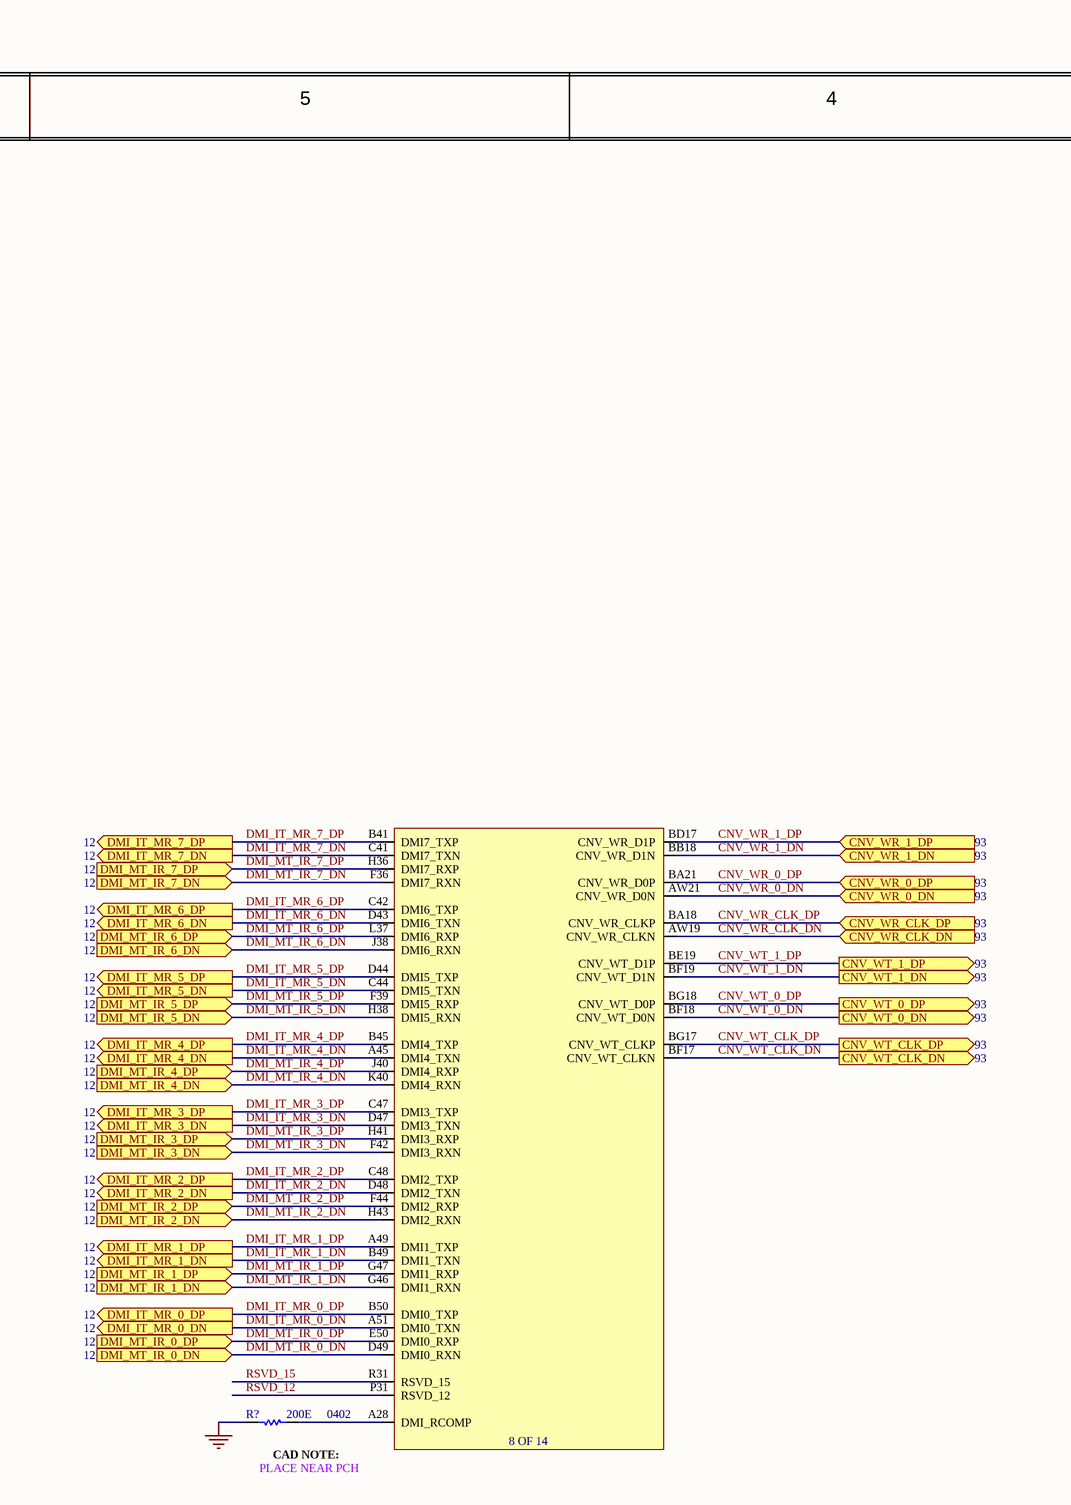
[diagram p58: 0036_PCH_DMI.SchDoc, top middle]
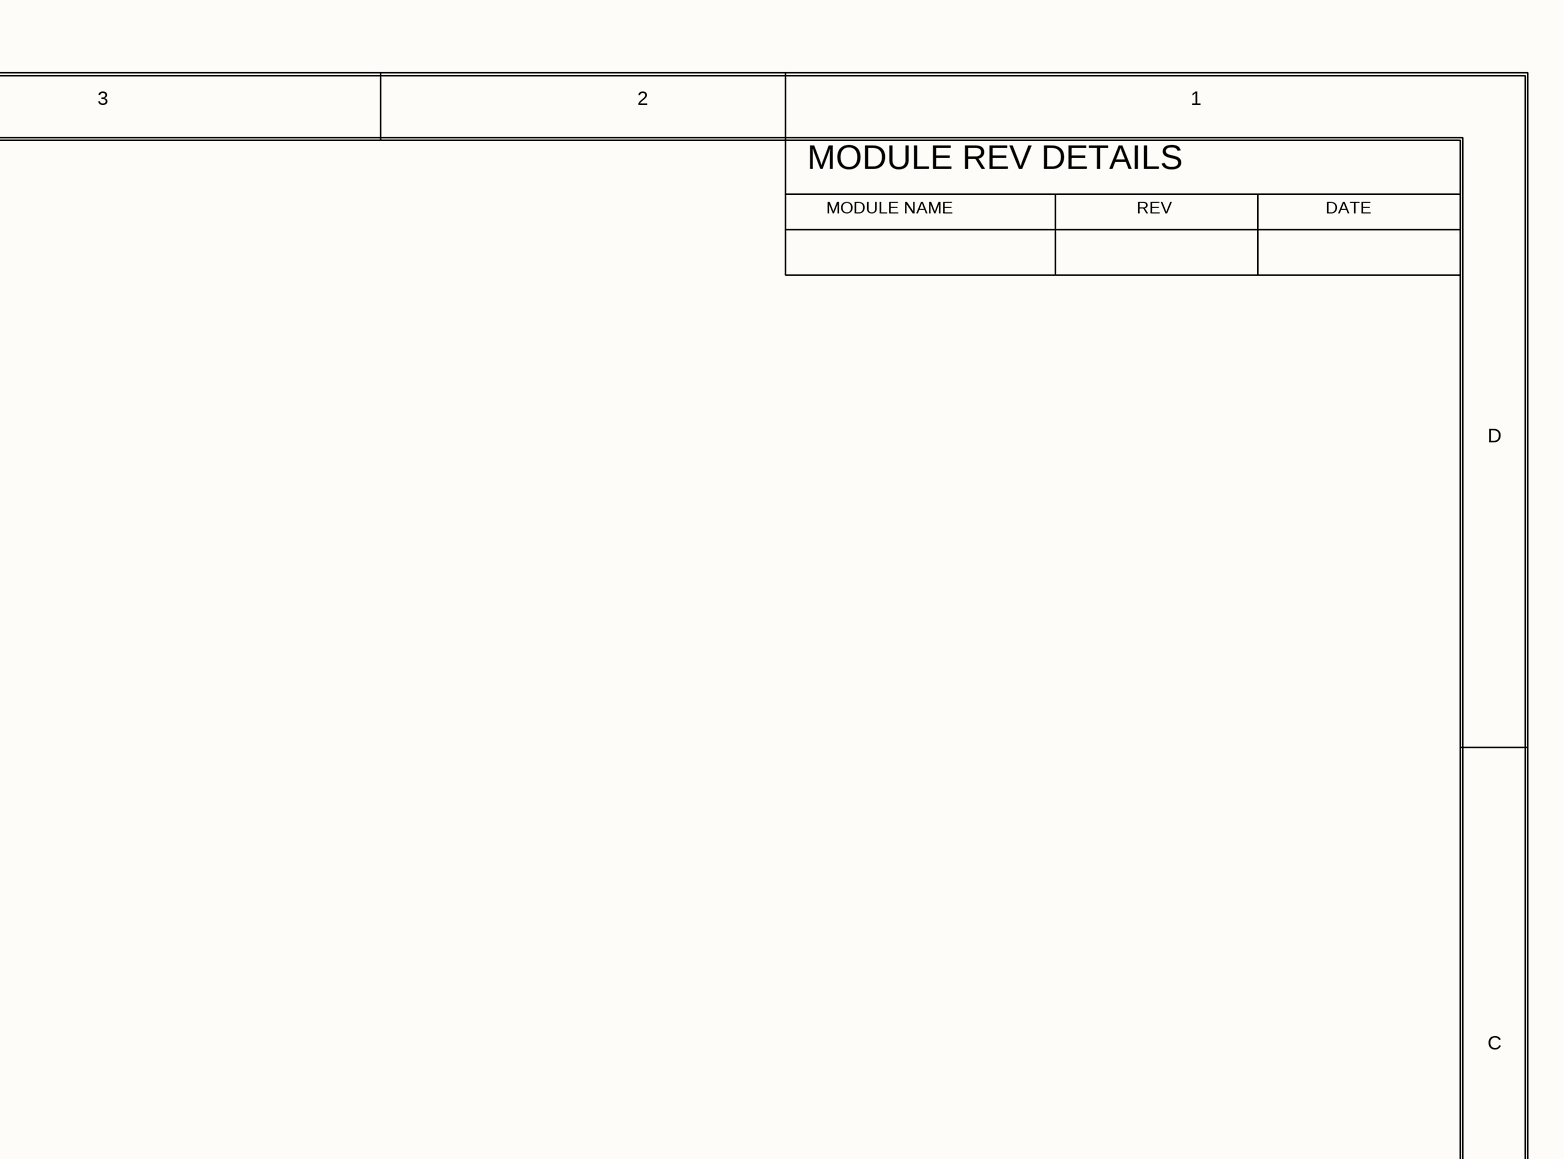
[diagram p59: 0036_PCH_DMI.SchDoc, top right]
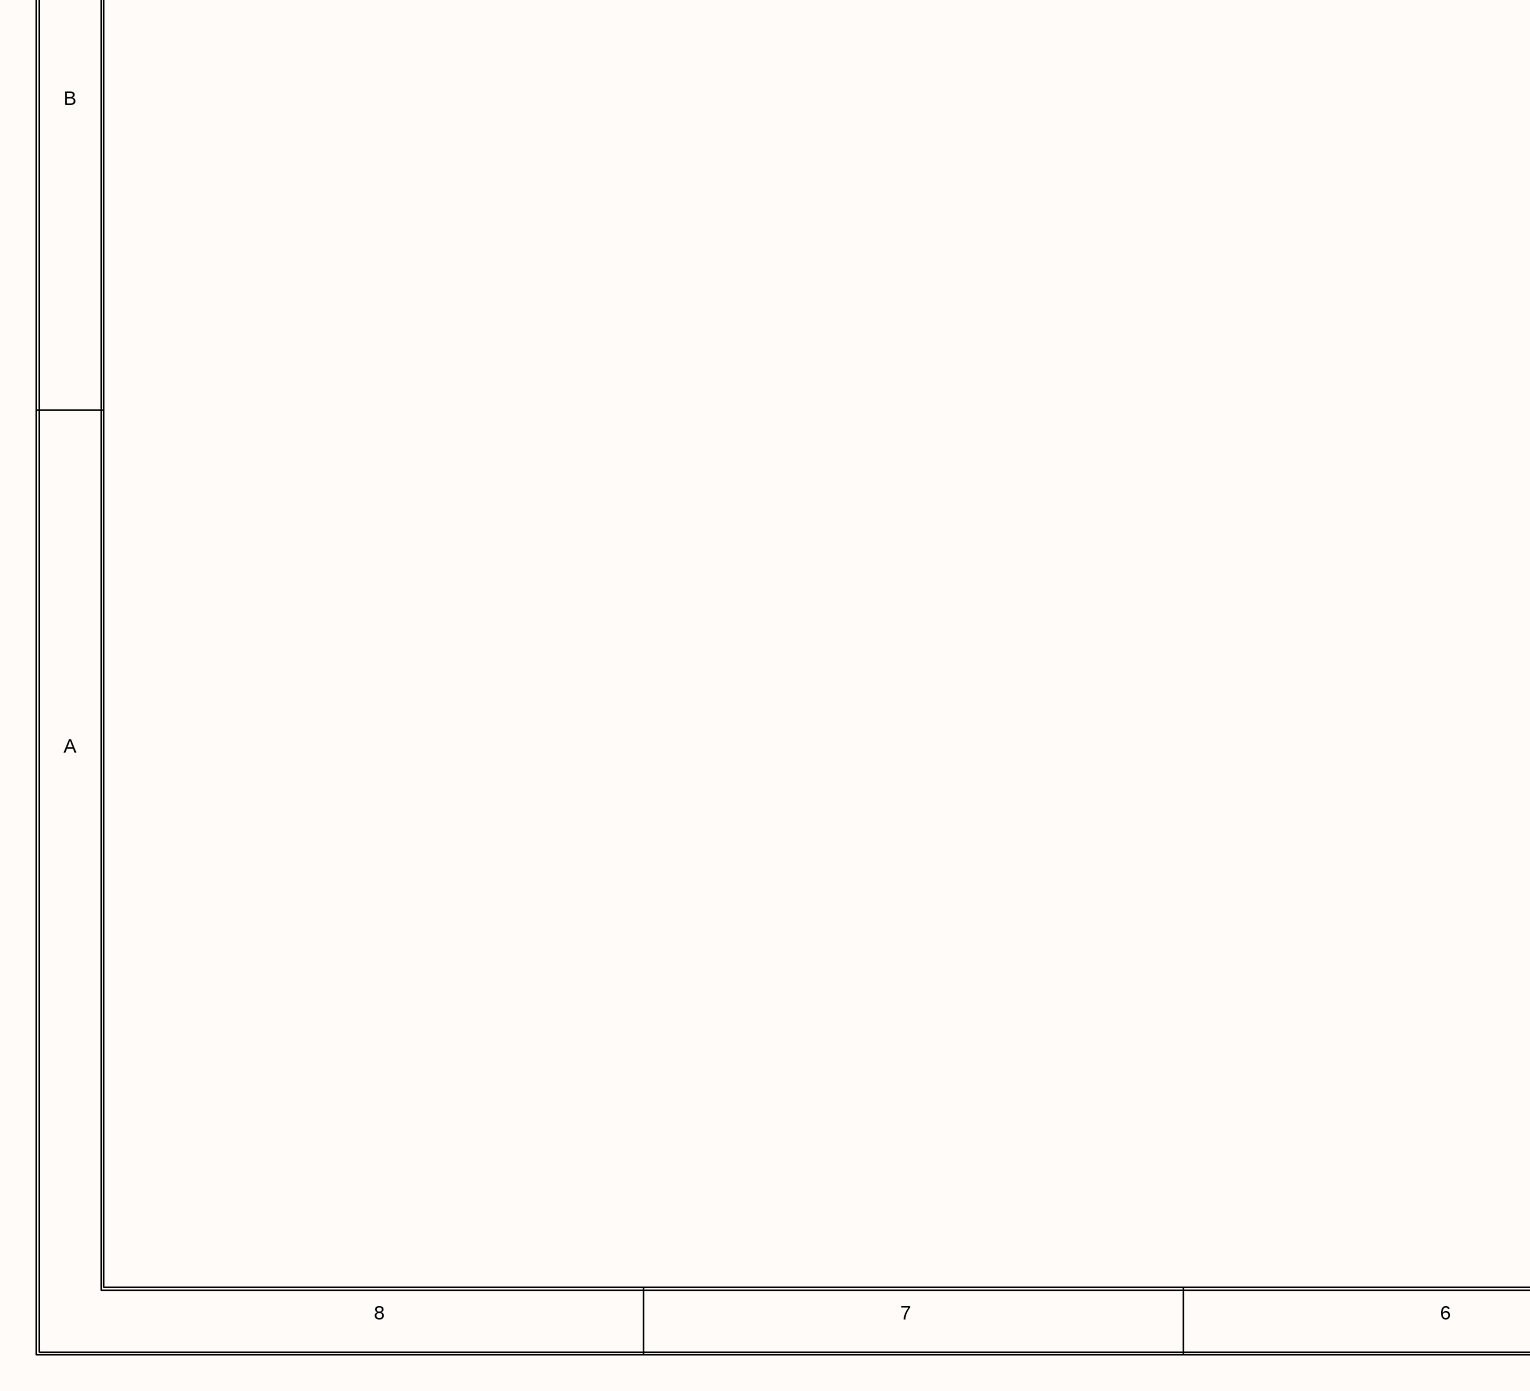
[diagram p60: 0036_PCH_DMI.SchDoc, bottom left]
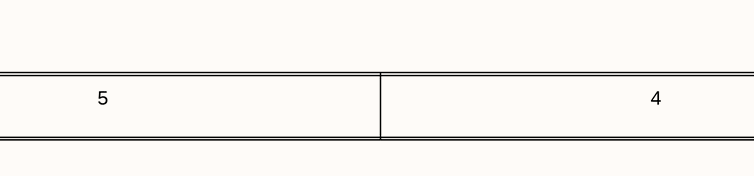
[diagram p61: 0036_PCH_DMI.SchDoc, bottom middle]
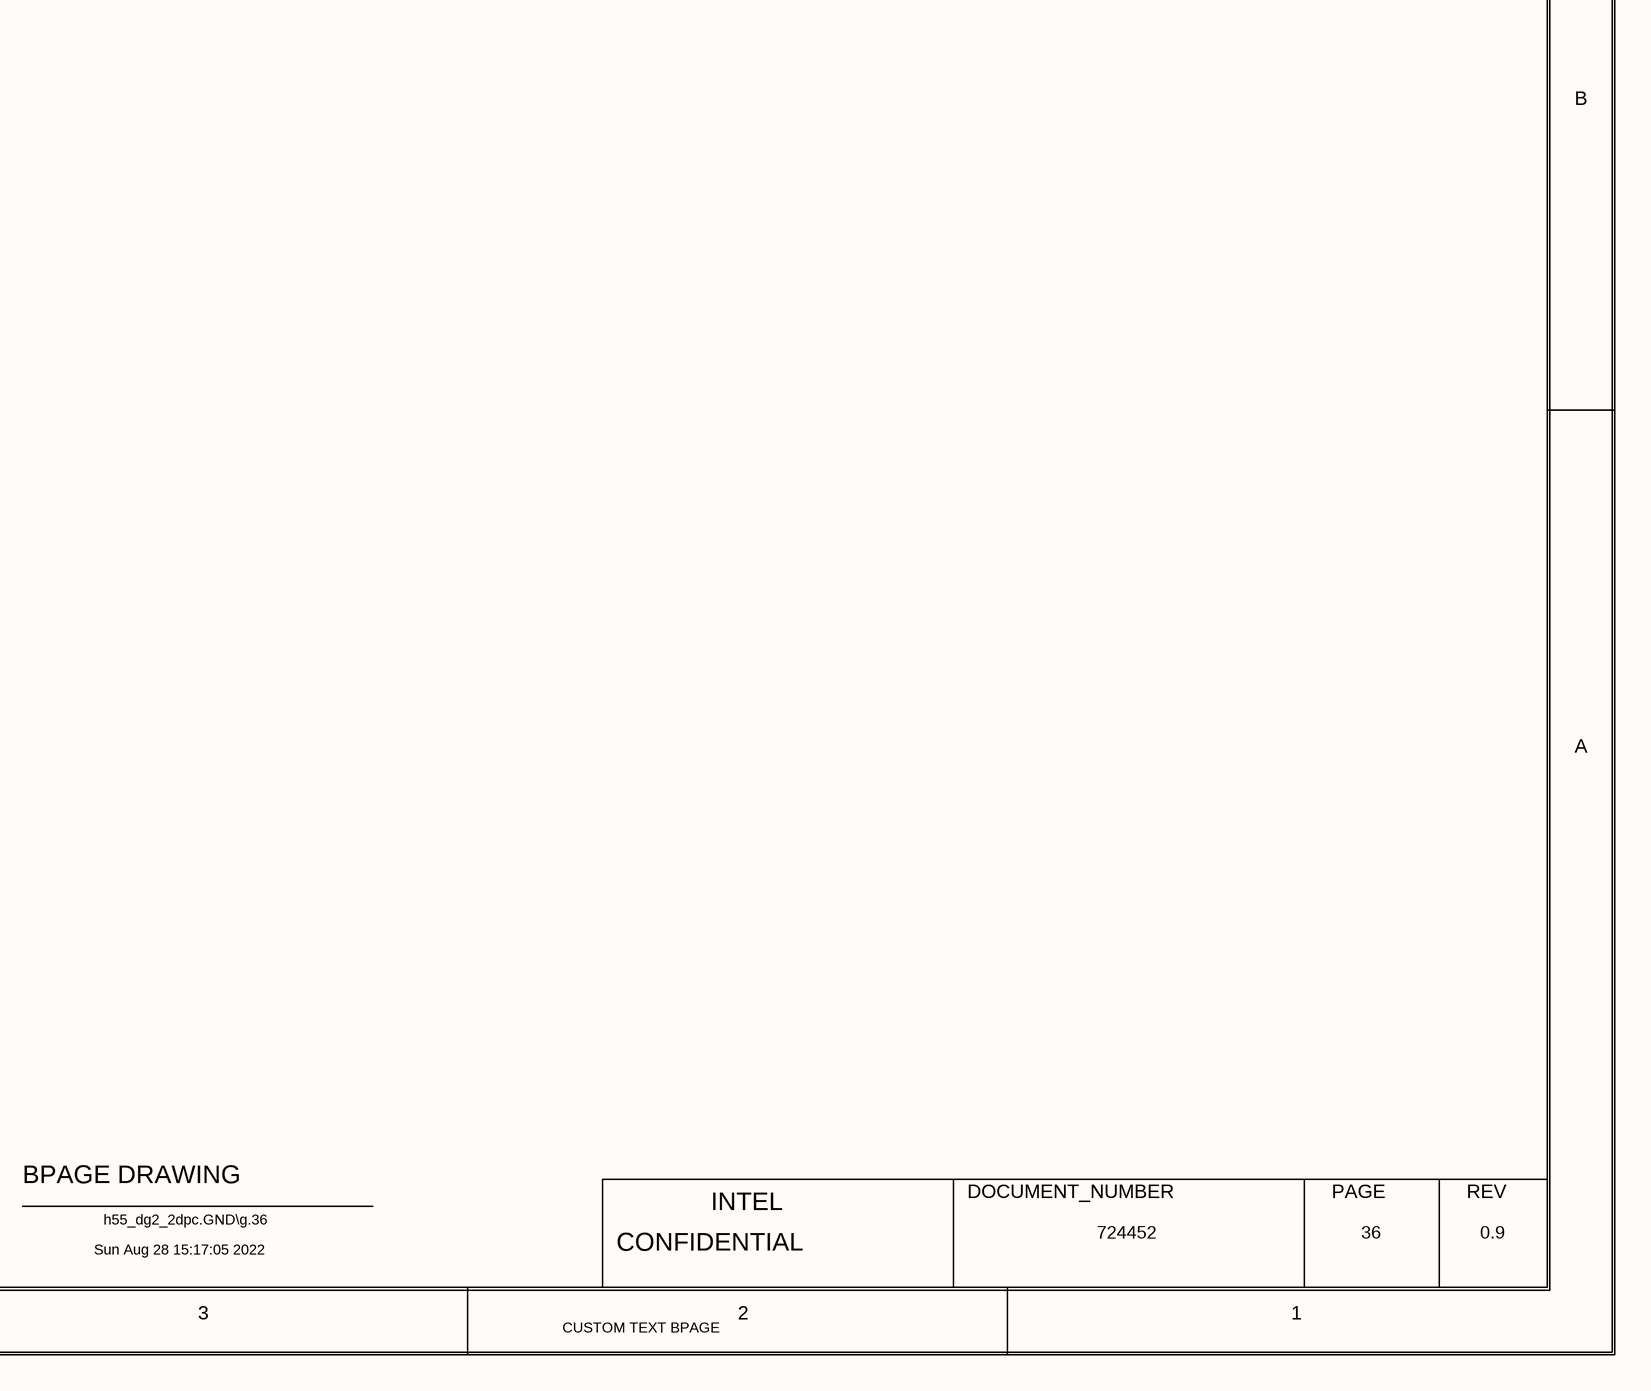
[diagram p62: 0036_PCH_DMI.SchDoc, bottom right]

### Parts
(Parts that share a designator on the sheet are numbered #1, #2 ... from top to bottom, then left to right.)
R?#151  value 200E  Case/Package: 0402  [RESC0402]  (hidden comment: Res)
U23601  C_RPL_S_PCH_EXT  (value not drawn)  (part H of 14)

### Ports
CNV_WR_0_DN (in), CNV_WR_0_DP (in), CNV_WR_1_DN (in), CNV_WR_1_DP (in), CNV_WR_CLK_DN (in), CNV_WR_CLK_DP (in), CNV_WT_0_DN (out), CNV_WT_0_DP (out), CNV_WT_1_DN (out), CNV_WT_1_DP (out), CNV_WT_CLK_DN (out), CNV_WT_CLK_DP (out), DMI_IT_MR_0_DN (out), DMI_IT_MR_0_DP (out), DMI_IT_MR_1_DN (out), DMI_IT_MR_1_DP (out), DMI_IT_MR_2_DN (out), DMI_IT_MR_2_DP (out), DMI_IT_MR_3_DN (out), DMI_IT_MR_3_DP (out), DMI_IT_MR_4_DN (out), DMI_IT_MR_4_DP (out), DMI_IT_MR_5_DN (out), DMI_IT_MR_5_DP (out), DMI_IT_MR_6_DN (out), DMI_IT_MR_6_DP (out), DMI_IT_MR_7_DN (out), DMI_IT_MR_7_DP (out), DMI_MT_IR_0_DN (in), DMI_MT_IR_0_DP (in), DMI_MT_IR_1_DN (in), DMI_MT_IR_1_DP (in), DMI_MT_IR_2_DN (in), DMI_MT_IR_2_DP (in), DMI_MT_IR_3_DN (in), DMI_MT_IR_3_DP (in), DMI_MT_IR_4_DN (in), DMI_MT_IR_4_DP (in), DMI_MT_IR_5_DN (in), DMI_MT_IR_5_DP (in), DMI_MT_IR_6_DN (in), DMI_MT_IR_6_DP (in), DMI_MT_IR_7_DN (in), DMI_MT_IR_7_DP (in)

### Nets
GND: R?#151.1  [project net EXP_A_RX_4_DP]
CNV_WR_0_DN: U23601.AW21(CNV_WR_D0N) ; port CNV_WR_0_DN
CNV_WR_0_DP: U23601.BA21(CNV_WR_D0P) ; port CNV_WR_0_DP
CNV_WR_1_DN: U23601.BB18(CNV_WR_D1N) ; port CNV_WR_1_DN
CNV_WR_1_DP: U23601.BD17(CNV_WR_D1P) ; port CNV_WR_1_DP
CNV_WR_CLK_DN: U23601.AW19(CNV_WR_CLKN) ; port CNV_WR_CLK_DN
CNV_WR_CLK_DP: U23601.BA18(CNV_WR_CLKP) ; port CNV_WR_CLK_DP
CNV_WT_0_DN: U23601.BF18(CNV_WT_D0N) ; port CNV_WT_0_DN
CNV_WT_0_DP: U23601.BG18(CNV_WT_D0P) ; port CNV_WT_0_DP
CNV_WT_1_DN: U23601.BF19(CNV_WT_D1N) ; port CNV_WT_1_DN
CNV_WT_1_DP: U23601.BE19(CNV_WT_D1P) ; port CNV_WT_1_DP
CNV_WT_CLK_DN: U23601.BF17(CNV_WT_CLKN) ; port CNV_WT_CLK_DN
CNV_WT_CLK_DP: U23601.BG17(CNV_WT_CLKP) ; port CNV_WT_CLK_DP
DMI_IT_MR_0_DN: U23601.A51(DMI0_TXN) ; port DMI_IT_MR_0_DN
DMI_IT_MR_0_DP: U23601.B50(DMI0_TXP) ; port DMI_IT_MR_0_DP
DMI_IT_MR_1_DN: U23601.B49(DMI1_TXN) ; port DMI_IT_MR_1_DN
DMI_IT_MR_1_DP: U23601.A49(DMI1_TXP) ; port DMI_IT_MR_1_DP
DMI_IT_MR_2_DN: U23601.D48(DMI2_TXN) ; port DMI_IT_MR_2_DN
DMI_IT_MR_2_DP: U23601.C48(DMI2_TXP) ; port DMI_IT_MR_2_DP
DMI_IT_MR_3_DN: U23601.D47(DMI3_TXN) ; port DMI_IT_MR_3_DN
DMI_IT_MR_3_DP: U23601.C47(DMI3_TXP) ; port DMI_IT_MR_3_DP
DMI_IT_MR_4_DN: U23601.A45(DMI4_TXN) ; port DMI_IT_MR_4_DN
DMI_IT_MR_4_DP: U23601.B45(DMI4_TXP) ; port DMI_IT_MR_4_DP
DMI_IT_MR_5_DN: U23601.C44(DMI5_TXN) ; port DMI_IT_MR_5_DN
DMI_IT_MR_5_DP: U23601.D44(DMI5_TXP) ; port DMI_IT_MR_5_DP
DMI_IT_MR_6_DN: U23601.D43(DMI6_TXN) ; port DMI_IT_MR_6_DN
DMI_IT_MR_6_DP: U23601.C42(DMI6_TXP) ; port DMI_IT_MR_6_DP
DMI_IT_MR_7_DN: U23601.C41(DMI7_TXN) ; port DMI_IT_MR_7_DN
DMI_IT_MR_7_DP: U23601.B41(DMI7_TXP) ; port DMI_IT_MR_7_DP
DMI_MT_IR_0_DN: U23601.D49(DMI0_RXN) ; port DMI_MT_IR_0_DN
DMI_MT_IR_0_DP: U23601.E50(DMI0_RXP) ; port DMI_MT_IR_0_DP
DMI_MT_IR_1_DN: U23601.G46(DMI1_RXN) ; port DMI_MT_IR_1_DN
DMI_MT_IR_1_DP: U23601.G47(DMI1_RXP) ; port DMI_MT_IR_1_DP
DMI_MT_IR_2_DN: U23601.H43(DMI2_RXN) ; port DMI_MT_IR_2_DN
DMI_MT_IR_2_DP: U23601.F44(DMI2_RXP) ; port DMI_MT_IR_2_DP
DMI_MT_IR_3_DN: U23601.F42(DMI3_RXN) ; port DMI_MT_IR_3_DN
DMI_MT_IR_3_DP: U23601.H41(DMI3_RXP) ; port DMI_MT_IR_3_DP
DMI_MT_IR_4_DN: U23601.K40(DMI4_RXN) ; port DMI_MT_IR_4_DN
DMI_MT_IR_4_DP: U23601.J40(DMI4_RXP) ; port DMI_MT_IR_4_DP
DMI_MT_IR_5_DN: U23601.H38(DMI5_RXN) ; port DMI_MT_IR_5_DN
DMI_MT_IR_5_DP: U23601.F39(DMI5_RXP) ; port DMI_MT_IR_5_DP
DMI_MT_IR_6_DN: U23601.J38(DMI6_RXN) ; port DMI_MT_IR_6_DN
DMI_MT_IR_6_DP: U23601.L37(DMI6_RXP) ; port DMI_MT_IR_6_DP
DMI_MT_IR_7_DN: U23601.F36(DMI7_RXN) ; port DMI_MT_IR_7_DN
DMI_MT_IR_7_DP: U23601.H36(DMI7_RXP) ; port DMI_MT_IR_7_DP
RSVD_12: U23601.P31(RSVD_12)
RSVD_15: U23601.R31(RSVD_15)
NetR?#151_2: R?#151.2 U23601.A28(DMI_RCOMP)

### Notes on the sheet
- <XR_PAGE_TITLE>
- 8
- 7
- 6
- 5
- 4
- 3
- 2
- 1
- MODULE REV DETAILS
- MODULE NAME
- REV
- DATE
- D
- C
- PLACE NEAR PCH
- (near R?#151) CAD NOTE:
- B
- A
- BPAGE DRAWING
- INTEL
- DOCUMENT_NUMBER
- PAGE
- Sun Aug 28 15:17:05 2022
- h55_dg2_2dpc.GND\g.36
- CONFIDENTIAL
- 724452
- 36
- 0.9
- CUSTOM TEXT BPAGE
- (in symbol C_RPL_S_PCH_EXT, part H) 8 OF 14

### Library data of the parts
R?#151 = Res: Thick Film Resistor -  200ohm, 1%, 0402
U23601 = C_RPL_S_PCH_EXT: Manufacturer Part Number: *; Case/Package: *

## Sheet 0037_PCH_PCIe_SATA.SchDoc
size A3
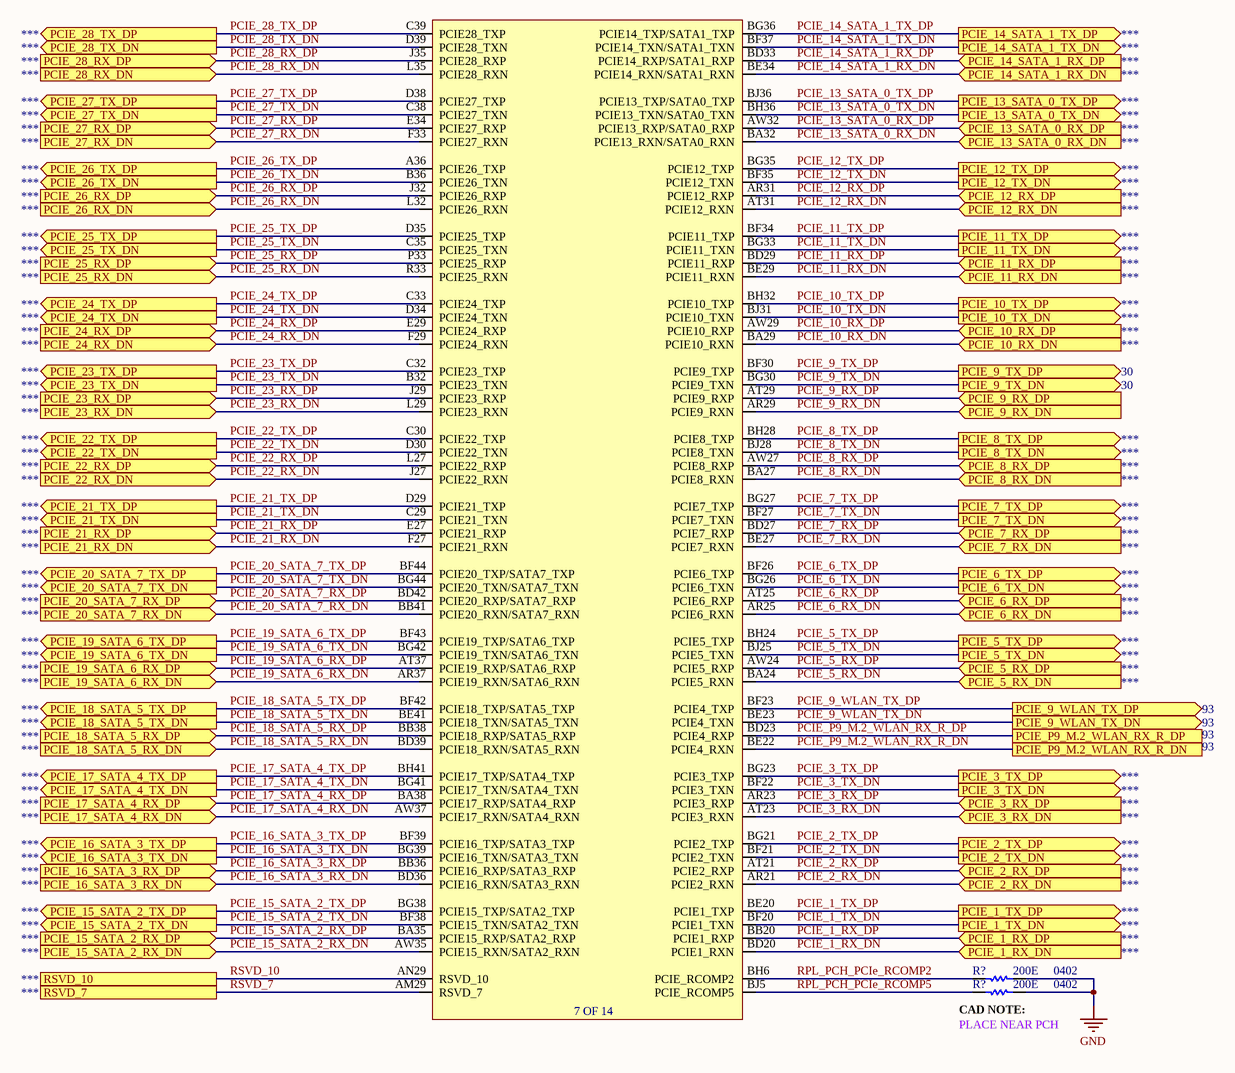
[diagram p63: 0037_PCH_PCIe_SATA.SchDoc]

### Parts
(Parts that share a designator on the sheet are numbered #1, #2 ... from top to bottom, then left to right.)
R?#152  value 200E  Case/Package: 0402  [RESC0402]  (hidden comment: Res)
R?#153  value 200E  Case/Package: 0402  [RESC0402]  (hidden comment: Res)
U23601  C_RPL_S_PCH_EXT  (value not drawn)  (part G of 14)

### Ports
PCIE_1_RX_DN (in), PCIE_1_RX_DP (in), PCIE_1_TX_DN (out), PCIE_1_TX_DP (out), PCIE_2_RX_DN (in), PCIE_2_RX_DP (in), PCIE_2_TX_DN (out), PCIE_2_TX_DP (out), PCIE_3_RX_DN (in), PCIE_3_RX_DP (in), PCIE_3_TX_DN (out), PCIE_3_TX_DP (out), PCIE_5_RX_DN (in), PCIE_5_RX_DP (in), PCIE_5_TX_DN (out), PCIE_5_TX_DP (out), PCIE_6_RX_DN (in), PCIE_6_RX_DP (in), PCIE_6_TX_DN (out), PCIE_6_TX_DP (out), PCIE_7_RX_DN (in), PCIE_7_RX_DP (in), PCIE_7_TX_DN (out), PCIE_7_TX_DP (out), PCIE_8_RX_DN (in), PCIE_8_RX_DP (in), PCIE_8_TX_DN (out), PCIE_8_TX_DP (out), PCIE_9_RX_DN (in), PCIE_9_RX_DP (in), PCIE_9_TX_DN (out), PCIE_9_TX_DP (out), PCIE_9_WLAN_TX_DN (out), PCIE_9_WLAN_TX_DP (out), PCIE_10_RX_DN (in), PCIE_10_RX_DP (in), PCIE_10_TX_DN (out), PCIE_10_TX_DP (out), PCIE_11_RX_DN (in), PCIE_11_RX_DP (in), PCIE_11_TX_DN (out), PCIE_11_TX_DP (out), PCIE_12_RX_DN (in), PCIE_12_RX_DP (in), PCIE_12_TX_DN (out), PCIE_12_TX_DP (out), PCIE_13_SATA_0_RX_DN (in), PCIE_13_SATA_0_RX_DP (in), PCIE_13_SATA_0_TX_DN (out), PCIE_13_SATA_0_TX_DP (out), PCIE_14_SATA_1_RX_DN (in), PCIE_14_SATA_1_RX_DP (in), PCIE_14_SATA_1_TX_DN (out), PCIE_14_SATA_1_TX_DP (out), PCIE_15_SATA_2_RX_DN (in), PCIE_15_SATA_2_RX_DP (in), PCIE_15_SATA_2_TX_DN (out), PCIE_15_SATA_2_TX_DP (out), PCIE_16_SATA_3_RX_DN (in), PCIE_16_SATA_3_RX_DP (in), PCIE_16_SATA_3_TX_DN (out), PCIE_16_SATA_3_TX_DP (out), PCIE_17_SATA_4_RX_DN (in), PCIE_17_SATA_4_RX_DP (in), PCIE_17_SATA_4_TX_DN (out), PCIE_17_SATA_4_TX_DP (out), PCIE_18_SATA_5_RX_DN (in), PCIE_18_SATA_5_RX_DP (in), PCIE_18_SATA_5_TX_DN (out), PCIE_18_SATA_5_TX_DP (out), PCIE_19_SATA_6_RX_DN (in), PCIE_19_SATA_6_RX_DP (in), PCIE_19_SATA_6_TX_DN (out), PCIE_19_SATA_6_TX_DP (out), PCIE_20_SATA_7_RX_DN (in), PCIE_20_SATA_7_RX_DP (in), PCIE_20_SATA_7_TX_DN (out), PCIE_20_SATA_7_TX_DP (out), PCIE_21_RX_DN (in), PCIE_21_RX_DP (in), PCIE_21_TX_DN (out), PCIE_21_TX_DP (out), PCIE_22_RX_DN (in), PCIE_22_RX_DP (in), PCIE_22_TX_DN (out), PCIE_22_TX_DP (out), PCIE_23_RX_DN (in), PCIE_23_RX_DP (in), PCIE_23_TX_DN (out), PCIE_23_TX_DP (out), PCIE_24_RX_DN (in), PCIE_24_RX_DP (in), PCIE_24_TX_DN (out), PCIE_24_TX_DP (out), PCIE_25_RX_DN (in), PCIE_25_RX_DP (in), PCIE_25_TX_DN (out), PCIE_25_TX_DP (out), PCIE_26_RX_DN (in), PCIE_26_RX_DP (in), PCIE_26_TX_DN (out), PCIE_26_TX_DP (out), PCIE_27_RX_DN (in), PCIE_27_RX_DP (in), PCIE_27_TX_DN (out), PCIE_27_TX_DP (out), PCIE_28_RX_DN (in), PCIE_28_RX_DP (in), PCIE_28_TX_DN (out), PCIE_28_TX_DP (out), PCIE_P9_M.2_WLAN_RX_R_DN, PCIE_P9_M.2_WLAN_RX_R_DP, RSVD_7, RSVD_10

### Nets
GND: R?#152.2 R?#153.2  [project net EXP_A_RX_4_DP]
PCIE_1_RX_DN: U23601.BD20(PCIE1_RXN) ; port PCIE_1_RX_DN
PCIE_1_RX_DP: U23601.BB20(PCIE1_RXP) ; port PCIE_1_RX_DP
PCIE_1_TX_DN: U23601.BF20(PCIE1_TXN) ; port PCIE_1_TX_DN
PCIE_1_TX_DP: U23601.BE20(PCIE1_TXP) ; port PCIE_1_TX_DP
PCIE_2_RX_DN: U23601.AR21(PCIE2_RXN) ; port PCIE_2_RX_DN
PCIE_2_RX_DP: U23601.AT21(PCIE2_RXP) ; port PCIE_2_RX_DP
PCIE_2_TX_DN: U23601.BF21(PCIE2_TXN) ; port PCIE_2_TX_DN
PCIE_2_TX_DP: U23601.BG21(PCIE2_TXP) ; port PCIE_2_TX_DP
PCIE_3_RX_DN: U23601.AT23(PCIE3_RXN) ; port PCIE_3_RX_DN
PCIE_3_RX_DP: U23601.AR23(PCIE3_RXP) ; port PCIE_3_RX_DP
PCIE_3_TX_DN: U23601.BF22(PCIE3_TXN) ; port PCIE_3_TX_DN
PCIE_3_TX_DP: U23601.BG23(PCIE3_TXP) ; port PCIE_3_TX_DP
PCIE_5_RX_DN: U23601.BA24(PCIE5_RXN) ; port PCIE_5_RX_DN
PCIE_5_RX_DP: U23601.AW24(PCIE5_RXP) ; port PCIE_5_RX_DP
PCIE_5_TX_DN: U23601.BJ25(PCIE5_TXN) ; port PCIE_5_TX_DN
PCIE_5_TX_DP: U23601.BH24(PCIE5_TXP) ; port PCIE_5_TX_DP
PCIE_6_RX_DN: U23601.AR25(PCIE6_RXN) ; port PCIE_6_RX_DN
PCIE_6_RX_DP: U23601.AT25(PCIE6_RXP) ; port PCIE_6_RX_DP
PCIE_6_TX_DN: U23601.BG26(PCIE6_TXN) ; port PCIE_6_TX_DN
PCIE_6_TX_DP: U23601.BF26(PCIE6_TXP) ; port PCIE_6_TX_DP
PCIE_7_RX_DN: U23601.BE27(PCIE7_RXN) ; port PCIE_7_RX_DN
PCIE_7_RX_DP: U23601.BD27(PCIE7_RXP) ; port PCIE_7_RX_DP
PCIE_7_TX_DN: U23601.BF27(PCIE7_TXN) ; port PCIE_7_TX_DN
PCIE_7_TX_DP: U23601.BG27(PCIE7_TXP) ; port PCIE_7_TX_DP
PCIE_8_RX_DN: U23601.BA27(PCIE8_RXN) ; port PCIE_8_RX_DN
PCIE_8_RX_DP: U23601.AW27(PCIE8_RXP) ; port PCIE_8_RX_DP
PCIE_8_TX_DN: U23601.BJ28(PCIE8_TXN) ; port PCIE_8_TX_DN
PCIE_8_TX_DP: U23601.BH28(PCIE8_TXP) ; port PCIE_8_TX_DP
PCIE_9_RX_DN: U23601.AR29(PCIE9_RXN) ; port PCIE_9_RX_DN
PCIE_9_RX_DP: U23601.AT29(PCIE9_RXP) ; port PCIE_9_RX_DP
PCIE_9_TX_DN: U23601.BG30(PCIE9_TXN) ; port PCIE_9_TX_DN
PCIE_9_TX_DP: U23601.BF30(PCIE9_TXP) ; port PCIE_9_TX_DP
PCIE_9_WLAN_TX_DN: U23601.BE23(PCIE4_TXN) ; port PCIE_9_WLAN_TX_DN
PCIE_9_WLAN_TX_DP: U23601.BF23(PCIE4_TXP) ; port PCIE_9_WLAN_TX_DP
PCIE_10_RX_DN: U23601.BA29(PCIE10_RXN) ; port PCIE_10_RX_DN
PCIE_10_RX_DP: U23601.AW29(PCIE10_RXP) ; port PCIE_10_RX_DP
PCIE_10_TX_DN: U23601.BJ31(PCIE10_TXN) ; port PCIE_10_TX_DN
PCIE_10_TX_DP: U23601.BH32(PCIE10_TXP) ; port PCIE_10_TX_DP
PCIE_11_RX_DN: U23601.BE29(PCIE11_RXN) ; port PCIE_11_RX_DN
PCIE_11_RX_DP: U23601.BD29(PCIE11_RXP) ; port PCIE_11_RX_DP
PCIE_11_TX_DN: U23601.BG33(PCIE11_TXN) ; port PCIE_11_TX_DN
PCIE_11_TX_DP: U23601.BF34(PCIE11_TXP) ; port PCIE_11_TX_DP
PCIE_12_RX_DN: U23601.AT31(PCIE12_RXN) ; port PCIE_12_RX_DN
PCIE_12_RX_DP: U23601.AR31(PCIE12_RXP) ; port PCIE_12_RX_DP
PCIE_12_TX_DN: U23601.BF35(PCIE12_TXN) ; port PCIE_12_TX_DN
PCIE_12_TX_DP: U23601.BG35(PCIE12_TXP) ; port PCIE_12_TX_DP
PCIE_13_SATA_0_RX_DN: U23601.BA32(PCIE13_RXN/SATA0_RXN) ; port PCIE_13_SATA_0_RX_DN
PCIE_13_SATA_0_RX_DP: U23601.AW32(PCIE13_RXP/SATA0_RXP) ; port PCIE_13_SATA_0_RX_DP
PCIE_13_SATA_0_TX_DN: U23601.BH36(PCIE13_TXN/SATA0_TXN) ; port PCIE_13_SATA_0_TX_DN
PCIE_13_SATA_0_TX_DP: U23601.BJ36(PCIE13_TXP/SATA0_TXP) ; port PCIE_13_SATA_0_TX_DP
PCIE_14_SATA_1_RX_DN: U23601.BE34(PCIE14_RXN/SATA1_RXN) ; port PCIE_14_SATA_1_RX_DN
PCIE_14_SATA_1_RX_DP: U23601.BD33(PCIE14_RXP/SATA1_RXP) ; port PCIE_14_SATA_1_RX_DP
PCIE_14_SATA_1_TX_DN: U23601.BF37(PCIE14_TXN/SATA1_TXN) ; port PCIE_14_SATA_1_TX_DN
PCIE_14_SATA_1_TX_DP: U23601.BG36(PCIE14_TXP/SATA1_TXP) ; port PCIE_14_SATA_1_TX_DP
PCIE_15_SATA_2_RX_DN: U23601.AW35(PCIE15_RXN/SATA2_RXN) ; port PCIE_15_SATA_2_RX_DN
PCIE_15_SATA_2_RX_DP: U23601.BA35(PCIE15_RXP/SATA2_RXP) ; port PCIE_15_SATA_2_RX_DP
PCIE_15_SATA_2_TX_DN: U23601.BF38(PCIE15_TXN/SATA2_TXN) ; port PCIE_15_SATA_2_TX_DN
PCIE_15_SATA_2_TX_DP: U23601.BG38(PCIE15_TXP/SATA2_TXP) ; port PCIE_15_SATA_2_TX_DP
PCIE_16_SATA_3_RX_DN: U23601.BD36(PCIE16_RXN/SATA3_RXN) ; port PCIE_16_SATA_3_RX_DN
PCIE_16_SATA_3_RX_DP: U23601.BB36(PCIE16_RXP/SATA3_RXP) ; port PCIE_16_SATA_3_RX_DP
PCIE_16_SATA_3_TX_DN: U23601.BG39(PCIE16_TXN/SATA3_TXN) ; port PCIE_16_SATA_3_TX_DN
PCIE_16_SATA_3_TX_DP: U23601.BF39(PCIE16_TXP/SATA3_TXP) ; port PCIE_16_SATA_3_TX_DP
PCIE_17_SATA_4_RX_DN: U23601.AW37(PCIE17_RXN/SATA4_RXN) ; port PCIE_17_SATA_4_RX_DN
PCIE_17_SATA_4_RX_DP: U23601.BA38(PCIE17_RXP/SATA4_RXP) ; port PCIE_17_SATA_4_RX_DP
PCIE_17_SATA_4_TX_DN: U23601.BG41(PCIE17_TXN/SATA4_TXN) ; port PCIE_17_SATA_4_TX_DN
PCIE_17_SATA_4_TX_DP: U23601.BH41(PCIE17_TXP/SATA4_TXP) ; port PCIE_17_SATA_4_TX_DP
PCIE_18_SATA_5_RX_DN: U23601.BD39(PCIE18_RXN/SATA5_RXN) ; port PCIE_18_SATA_5_RX_DN
PCIE_18_SATA_5_RX_DP: U23601.BB38(PCIE18_RXP/SATA5_RXP) ; port PCIE_18_SATA_5_RX_DP
PCIE_18_SATA_5_TX_DN: U23601.BE41(PCIE18_TXN/SATA5_TXN) ; port PCIE_18_SATA_5_TX_DN
PCIE_18_SATA_5_TX_DP: U23601.BF42(PCIE18_TXP/SATA5_TXP) ; port PCIE_18_SATA_5_TX_DP
PCIE_19_SATA_6_RX_DN: U23601.AR37(PCIE19_RXN/SATA6_RXN) ; port PCIE_19_SATA_6_RX_DN
PCIE_19_SATA_6_RX_DP: U23601.AT37(PCIE19_RXP/SATA6_RXP) ; port PCIE_19_SATA_6_RX_DP
PCIE_19_SATA_6_TX_DN: U23601.BG42(PCIE19_TXN/SATA6_TXN) ; port PCIE_19_SATA_6_TX_DN
PCIE_19_SATA_6_TX_DP: U23601.BF43(PCIE19_TXP/SATA6_TXP) ; port PCIE_19_SATA_6_TX_DP
PCIE_20_SATA_7_RX_DN: U23601.BB41(PCIE20_RXN/SATA7_RXN) ; port PCIE_20_SATA_7_RX_DN
PCIE_20_SATA_7_RX_DP: U23601.BD42(PCIE20_RXP/SATA7_RXP) ; port PCIE_20_SATA_7_RX_DP
PCIE_20_SATA_7_TX_DN: U23601.BG44(PCIE20_TXN/SATA7_TXN) ; port PCIE_20_SATA_7_TX_DN
PCIE_20_SATA_7_TX_DP: U23601.BF44(PCIE20_TXP/SATA7_TXP) ; port PCIE_20_SATA_7_TX_DP
PCIE_21_RX_DN: U23601.F27(PCIE21_RXN) ; port PCIE_21_RX_DN
PCIE_21_RX_DP: U23601.E27(PCIE21_RXP) ; port PCIE_21_RX_DP
PCIE_21_TX_DN: U23601.C29(PCIE21_TXN) ; port PCIE_21_TX_DN
PCIE_21_TX_DP: U23601.D29(PCIE21_TXP) ; port PCIE_21_TX_DP
PCIE_22_RX_DN: U23601.J27(PCIE22_RXN) ; port PCIE_22_RX_DN
PCIE_22_RX_DP: U23601.L27(PCIE22_RXP) ; port PCIE_22_RX_DP
PCIE_22_TX_DN: U23601.D30(PCIE22_TXN) ; port PCIE_22_TX_DN
PCIE_22_TX_DP: U23601.C30(PCIE22_TXP) ; port PCIE_22_TX_DP
PCIE_23_RX_DN: U23601.L29(PCIE23_RXN) ; port PCIE_23_RX_DN
PCIE_23_RX_DP: U23601.J29(PCIE23_RXP) ; port PCIE_23_RX_DP
PCIE_23_TX_DN: U23601.B32(PCIE23_TXN) ; port PCIE_23_TX_DN
PCIE_23_TX_DP: U23601.C32(PCIE23_TXP) ; port PCIE_23_TX_DP
PCIE_24_RX_DN: U23601.F29(PCIE24_RXN) ; port PCIE_24_RX_DN
PCIE_24_RX_DP: U23601.E29(PCIE24_RXP) ; port PCIE_24_RX_DP
PCIE_24_TX_DN: U23601.D34(PCIE24_TXN) ; port PCIE_24_TX_DN
PCIE_24_TX_DP: U23601.C33(PCIE24_TXP) ; port PCIE_24_TX_DP
PCIE_25_RX_DN: U23601.R33(PCIE25_RXN) ; port PCIE_25_RX_DN
PCIE_25_RX_DP: U23601.P33(PCIE25_RXP) ; port PCIE_25_RX_DP
PCIE_25_TX_DN: U23601.C35(PCIE25_TXN) ; port PCIE_25_TX_DN
PCIE_25_TX_DP: U23601.D35(PCIE25_TXP) ; port PCIE_25_TX_DP
PCIE_26_RX_DN: U23601.L32(PCIE26_RXN) ; port PCIE_26_RX_DN
PCIE_26_RX_DP: U23601.J32(PCIE26_RXP) ; port PCIE_26_RX_DP
PCIE_26_TX_DN: U23601.B36(PCIE26_TXN) ; port PCIE_26_TX_DN
PCIE_26_TX_DP: U23601.A36(PCIE26_TXP) ; port PCIE_26_TX_DP
PCIE_27_RX_DN: U23601.F33(PCIE27_RXN) ; port PCIE_27_RX_DN
PCIE_27_RX_DP: U23601.E34(PCIE27_RXP) ; port PCIE_27_RX_DP
PCIE_27_TX_DN: U23601.C38(PCIE27_TXN) ; port PCIE_27_TX_DN
PCIE_27_TX_DP: U23601.D38(PCIE27_TXP) ; port PCIE_27_TX_DP
PCIE_28_RX_DN: U23601.L35(PCIE28_RXN) ; port PCIE_28_RX_DN
PCIE_28_RX_DP: U23601.J35(PCIE28_RXP) ; port PCIE_28_RX_DP
PCIE_28_TX_DN: U23601.D39(PCIE28_TXN) ; port PCIE_28_TX_DN
PCIE_28_TX_DP: U23601.C39(PCIE28_TXP) ; port PCIE_28_TX_DP
PCIE_P9_M.2_WLAN_RX_R_DN: U23601.BE22(PCIE4_RXN) ; port PCIE_P9_M.2_WLAN_RX_R_DN
PCIE_P9_M.2_WLAN_RX_R_DP: U23601.BD23(PCIE4_RXP) ; port PCIE_P9_M.2_WLAN_RX_R_DP
RPL_PCH_PCIe_RCOMP2: R?#152.1 U23601.BH6(PCIE_RCOMP2)
RPL_PCH_PCIe_RCOMP5: R?#153.1 U23601.BJ5(PCIE_RCOMP5)
RSVD_7: U23601.AM29(RSVD_7) ; port RSVD_7
RSVD_10: U23601.AN29(RSVD_10) ; port RSVD_10

### Notes on the sheet
- (near R?#153) CAD NOTE:
- (near R?#153) PLACE NEAR PCH
- (in symbol C_RPL_S_PCH_EXT, part G) 7 OF 14

### Library data of the parts
R?#152 R?#153 = Res: Thick Film Resistor -  200ohm, 1%, 0402
U23601 = C_RPL_S_PCH_EXT: Manufacturer Part Number: *; Case/Package: *

## Sheet 0038_PCH_USB.SchDoc
size A3
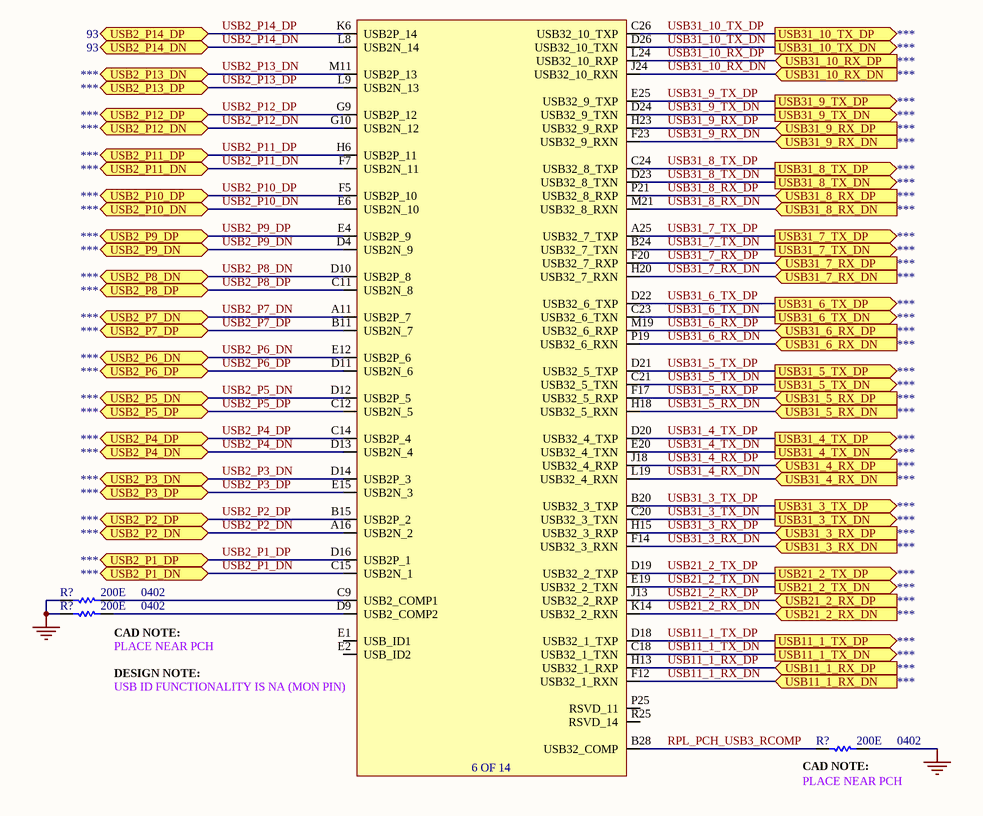
[diagram p64: 0038_PCH_USB.SchDoc]

### Parts
(Parts that share a designator on the sheet are numbered #1, #2 ... from top to bottom, then left to right.)
R?#154  value 200E  Case/Package: 0402  [RESC0402]  (hidden comment: Res)
R?#155  value 200E  Case/Package: 0402  [RESC0402]  (hidden comment: Res)
R?#156  value 200E  Case/Package: 0402  [RESC0402]  (hidden comment: Res)
U23601  C_RPL_S_PCH_EXT  (value not drawn)  (part F of 14)

### Ports
USB2_P1_DN (bidir), USB2_P1_DP (bidir), USB2_P2_DN (bidir), USB2_P2_DP (bidir), USB2_P3_DN (bidir), USB2_P3_DP (bidir), USB2_P4_DN (bidir), USB2_P4_DP (bidir), USB2_P5_DN (bidir), USB2_P5_DP (bidir), USB2_P6_DN (bidir), USB2_P6_DP (bidir), USB2_P7_DN (bidir), USB2_P7_DP (bidir), USB2_P8_DN (bidir), USB2_P8_DP (bidir), USB2_P9_DN (bidir), USB2_P9_DP (bidir), USB2_P10_DN (bidir), USB2_P10_DP (bidir), USB2_P11_DN (bidir), USB2_P11_DP (bidir), USB2_P12_DN (bidir), USB2_P12_DP (bidir), USB2_P13_DN (bidir), USB2_P13_DP (bidir), USB2_P14_DN (bidir), USB2_P14_DP (bidir), USB11_1_RX_DN (in), USB11_1_RX_DP (in), USB11_1_TX_DN (out), USB11_1_TX_DP (out), USB21_2_RX_DN (in), USB21_2_RX_DP (in), USB21_2_TX_DN (out), USB21_2_TX_DP (out), USB31_3_RX_DN (in), USB31_3_RX_DP (in), USB31_3_TX_DN (out), USB31_3_TX_DP (out), USB31_4_RX_DN (in), USB31_4_RX_DP (in), USB31_4_TX_DN (out), USB31_4_TX_DP (out), USB31_5_RX_DN (in), USB31_5_RX_DP (in), USB31_5_TX_DN (out), USB31_5_TX_DP (out), USB31_6_RX_DN (in), USB31_6_RX_DP (in), USB31_6_TX_DN (out), USB31_6_TX_DP (out), USB31_7_RX_DN (in), USB31_7_RX_DP (in), USB31_7_TX_DN (out), USB31_7_TX_DP (out), USB31_8_RX_DN (in), USB31_8_RX_DP (in), USB31_8_TX_DN (out), USB31_8_TX_DP (out), USB31_9_RX_DN (in), USB31_9_RX_DP (in), USB31_9_TX_DN (out), USB31_9_TX_DP (out), USB31_10_RX_DN (in), USB31_10_RX_DP (in), USB31_10_TX_DN (out), USB31_10_TX_DP (out)

### Nets
GND: R?#154.1 R?#155.1 R?#156.2  [project net EXP_A_RX_4_DP]
RPL_PCH_USB3_RCOMP: R?#156.1 U23601.B28(USB32_COMP)
USB2_P1_DN: U23601.C15(USB2N_1) ; port USB2_P1_DN
USB2_P1_DP: U23601.D16(USB2P_1) ; port USB2_P1_DP
USB2_P2_DN: U23601.A16(USB2N_2) ; port USB2_P2_DN
USB2_P2_DP: U23601.B15(USB2P_2) ; port USB2_P2_DP
USB2_P3_DN: U23601.D14(USB2P_3) ; port USB2_P3_DN
USB2_P3_DP: U23601.E15(USB2N_3) ; port USB2_P3_DP
USB2_P4_DN: U23601.D13(USB2N_4) ; port USB2_P4_DN
USB2_P4_DP: U23601.C14(USB2P_4) ; port USB2_P4_DP
USB2_P5_DN: U23601.D12(USB2P_5) ; port USB2_P5_DN
USB2_P5_DP: U23601.C12(USB2N_5) ; port USB2_P5_DP
USB2_P6_DN: U23601.E12(USB2P_6) ; port USB2_P6_DN
USB2_P6_DP: U23601.D11(USB2N_6) ; port USB2_P6_DP
USB2_P7_DN: U23601.A11(USB2P_7) ; port USB2_P7_DN
USB2_P7_DP: U23601.B11(USB2N_7) ; port USB2_P7_DP
USB2_P8_DN: U23601.D10(USB2P_8) ; port USB2_P8_DN
USB2_P8_DP: U23601.C11(USB2N_8) ; port USB2_P8_DP
USB2_P9_DN: U23601.D4(USB2N_9) ; port USB2_P9_DN
USB2_P9_DP: U23601.E4(USB2P_9) ; port USB2_P9_DP
USB2_P10_DN: U23601.E6(USB2N_10) ; port USB2_P10_DN
USB2_P10_DP: U23601.F5(USB2P_10) ; port USB2_P10_DP
USB2_P11_DN: U23601.F7(USB2N_11) ; port USB2_P11_DN
USB2_P11_DP: U23601.H6(USB2P_11) ; port USB2_P11_DP
USB2_P12_DN: U23601.G10(USB2N_12) ; port USB2_P12_DN
USB2_P12_DP: U23601.G9(USB2P_12) ; port USB2_P12_DP
USB2_P13_DN: U23601.M11(USB2P_13) ; port USB2_P13_DN
USB2_P13_DP: U23601.L9(USB2N_13) ; port USB2_P13_DP
USB2_P14_DN: U23601.L8(USB2N_14) ; port USB2_P14_DN
USB2_P14_DP: U23601.K6(USB2P_14) ; port USB2_P14_DP
USB11_1_RX_DN: U23601.F12(USB32_1_RXN) ; port USB11_1_RX_DN
USB11_1_RX_DP: U23601.H13(USB32_1_RXP) ; port USB11_1_RX_DP
USB11_1_TX_DN: U23601.C18(USB32_1_TXN) ; port USB11_1_TX_DN
USB11_1_TX_DP: U23601.D18(USB32_1_TXP) ; port USB11_1_TX_DP
USB21_2_RX_DN: U23601.K14(USB32_2_RXN) ; port USB21_2_RX_DN
USB21_2_RX_DP: U23601.J13(USB32_2_RXP) ; port USB21_2_RX_DP
USB21_2_TX_DN: U23601.E19(USB32_2_TXN) ; port USB21_2_TX_DN
USB21_2_TX_DP: U23601.D19(USB32_2_TXP) ; port USB21_2_TX_DP
USB31_3_RX_DN: U23601.F14(USB32_3_RXN) ; port USB31_3_RX_DN
USB31_3_RX_DP: U23601.H15(USB32_3_RXP) ; port USB31_3_RX_DP
USB31_3_TX_DN: U23601.C20(USB32_3_TXN) ; port USB31_3_TX_DN
USB31_3_TX_DP: U23601.B20(USB32_3_TXP) ; port USB31_3_TX_DP
USB31_4_RX_DN: U23601.L19(USB32_4_RXN) ; port USB31_4_RX_DN
USB31_4_RX_DP: U23601.J18(USB32_4_RXP) ; port USB31_4_RX_DP
USB31_4_TX_DN: U23601.E20(USB32_4_TXN) ; port USB31_4_TX_DN
USB31_4_TX_DP: U23601.D20(USB32_4_TXP) ; port USB31_4_TX_DP
USB31_5_RX_DN: U23601.H18(USB32_5_RXN) ; port USB31_5_RX_DN
USB31_5_RX_DP: U23601.F17(USB32_5_RXP) ; port USB31_5_RX_DP
USB31_5_TX_DN: U23601.C21(USB32_5_TXN) ; port USB31_5_TX_DN
USB31_5_TX_DP: U23601.D21(USB32_5_TXP) ; port USB31_5_TX_DP
USB31_6_RX_DN: U23601.P19(USB32_6_RXN) ; port USB31_6_RX_DN
USB31_6_RX_DP: U23601.M19(USB32_6_RXP) ; port USB31_6_RX_DP
USB31_6_TX_DN: U23601.C23(USB32_6_TXN) ; port USB31_6_TX_DN
USB31_6_TX_DP: U23601.D22(USB32_6_TXP) ; port USB31_6_TX_DP
USB31_7_RX_DN: U23601.H20(USB32_7_RXN) ; port USB31_7_RX_DN
USB31_7_RX_DP: U23601.F20(USB32_7_RXP) ; port USB31_7_RX_DP
USB31_7_TX_DN: U23601.B24(USB32_7_TXN) ; port USB31_7_TX_DN
USB31_7_TX_DP: U23601.A25(USB32_7_TXP) ; port USB31_7_TX_DP
USB31_8_RX_DN: U23601.M21(USB32_8_RXN) ; port USB31_8_RX_DN
USB31_8_RX_DP: U23601.P21(USB32_8_RXP) ; port USB31_8_RX_DP
USB31_8_TX_DN: U23601.D23(USB32_8_TXN) ; port USB31_8_TX_DN
USB31_8_TX_DP: U23601.C24(USB32_8_TXP) ; port USB31_8_TX_DP
USB31_9_RX_DN: U23601.F23(USB32_9_RXN) ; port USB31_9_RX_DN
USB31_9_RX_DP: U23601.H23(USB32_9_RXP) ; port USB31_9_RX_DP
USB31_9_TX_DN: U23601.D24(USB32_9_TXN) ; port USB31_9_TX_DN
USB31_9_TX_DP: U23601.E25(USB32_9_TXP) ; port USB31_9_TX_DP
USB31_10_RX_DN: U23601.J24(USB32_10_RXN) ; port USB31_10_RX_DN
USB31_10_RX_DP: U23601.L24(USB32_10_RXP) ; port USB31_10_RX_DP
USB31_10_TX_DN: U23601.D26(USB32_10_TXN) ; port USB31_10_TX_DN
USB31_10_TX_DP: U23601.C26(USB32_10_TXP) ; port USB31_10_TX_DP
NetR?#154_2: R?#154.2 U23601.C9(USB2_COMP1)
NetR?#155_2: R?#155.2 U23601.D9(USB2_COMP2)

Not connected (* = marked no-connect by the designer): U23601 E1(USB_ID1) E2(USB_ID2) P25(RSVD_11) R25(RSVD_14)

### Notes on the sheet
- (near R?#155) CAD NOTE:
- (near R?#155) PLACE NEAR PCH
- DESIGN NOTE:
- (near U23601) USB ID FUNCTIONALITY IS NA (MON PIN)
- (near R?#156) CAD NOTE:
- (near R?#156) PLACE NEAR PCH
- (in symbol C_RPL_S_PCH_EXT, part F) 6 OF 14

### Library data of the parts
R?#154-R?#156 = Res: Thick Film Resistor -  200ohm, 1%, 0402
U23601 = C_RPL_S_PCH_EXT: Manufacturer Part Number: *; Case/Package: *

## Sheet 0039_GPP_C_D_E.SchDoc
size A3
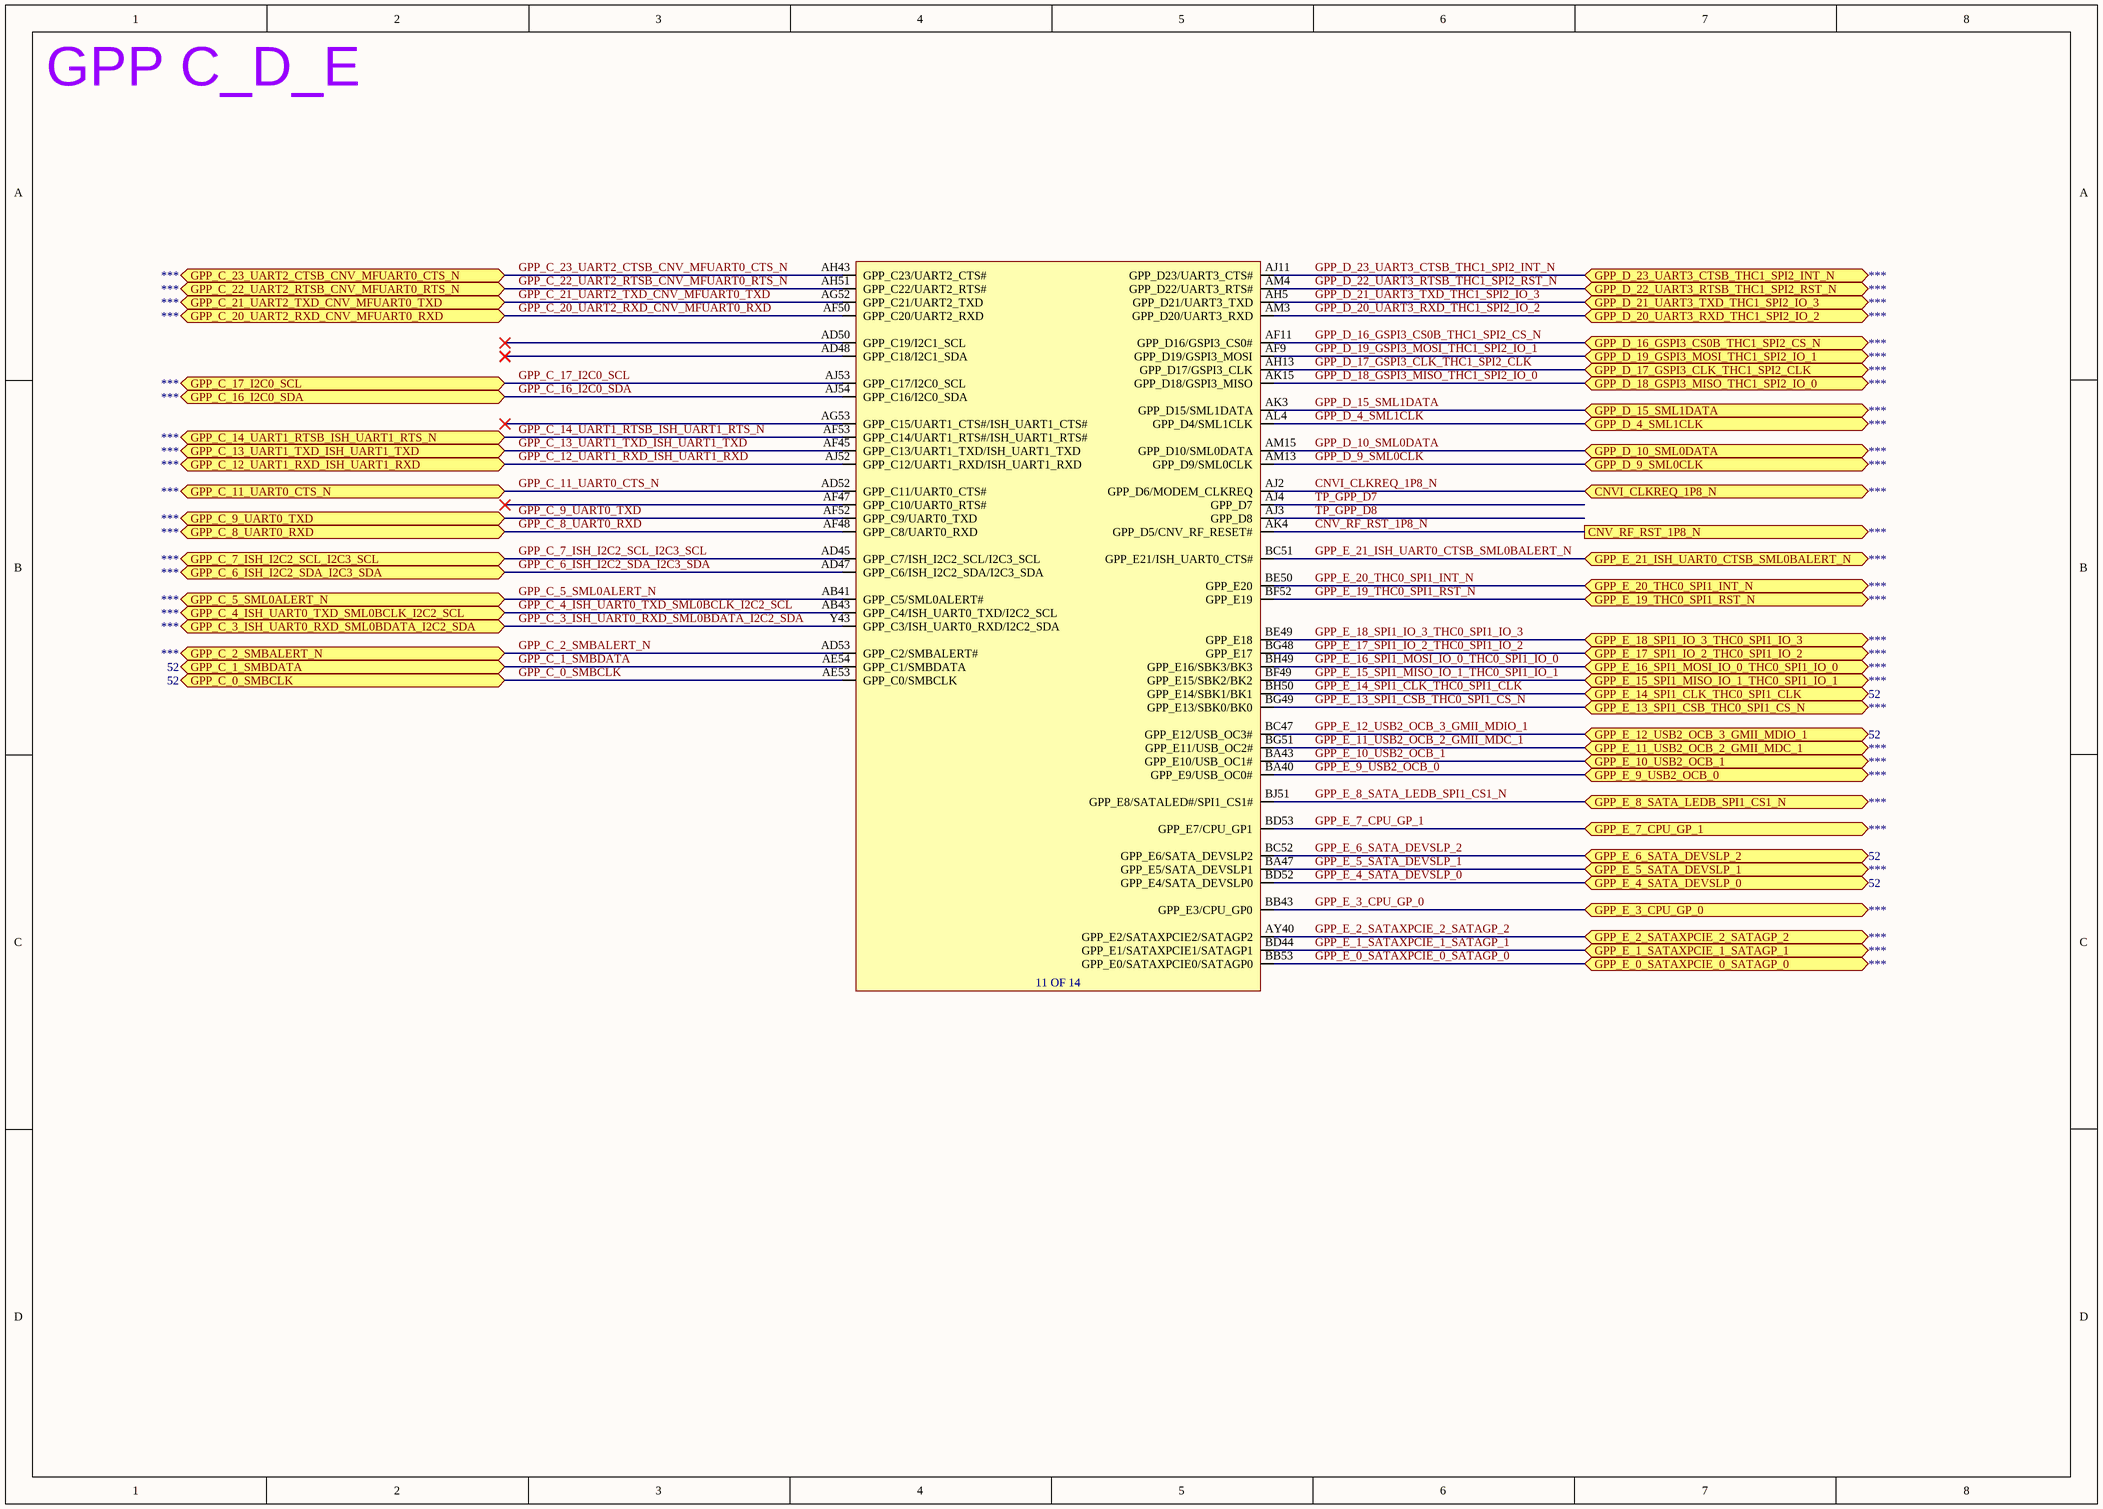
[diagram p65: 0039_GPP_C_D_E.SchDoc]

### Parts
U23601  C_RPL_S_PCH_EXT  (value not drawn)  (part K of 14)

### Ports
CNV_RF_RST_1P8_N (out), CNVI_CLKREQ_1P8_N (bidir), GPP_C_0_SMBCLK (bidir), GPP_C_1_SMBDATA (bidir), GPP_C_2_SMBALERT_N (bidir), GPP_C_3_ISH_UART0_RXD_SML0BDATA_I2C2_SDA (bidir), GPP_C_4_ISH_UART0_TXD_SML0BCLK_I2C2_SCL (bidir), GPP_C_5_SML0ALERT_N (bidir), GPP_C_6_ISH_I2C2_SDA_I2C3_SDA (bidir), GPP_C_7_ISH_I2C2_SCL_I2C3_SCL (bidir), GPP_C_8_UART0_RXD (bidir), GPP_C_9_UART0_TXD (bidir), GPP_C_11_UART0_CTS_N (bidir), GPP_C_12_UART1_RXD_ISH_UART1_RXD (bidir), GPP_C_13_UART1_TXD_ISH_UART1_TXD (bidir), GPP_C_14_UART1_RTSB_ISH_UART1_RTS_N (bidir), GPP_C_16_I2C0_SDA (bidir), GPP_C_17_I2C0_SCL (bidir), GPP_C_20_UART2_RXD_CNV_MFUART0_RXD (bidir), GPP_C_21_UART2_TXD_CNV_MFUART0_TXD (bidir), GPP_C_22_UART2_RTSB_CNV_MFUART0_RTS_N (bidir), GPP_C_23_UART2_CTSB_CNV_MFUART0_CTS_N (bidir), GPP_D_4_SML1CLK (bidir), GPP_D_9_SML0CLK (bidir), GPP_D_10_SML0DATA (bidir), GPP_D_15_SML1DATA (bidir), GPP_D_16_GSPI3_CS0B_THC1_SPI2_CS_N (bidir), GPP_D_17_GSPI3_CLK_THC1_SPI2_CLK (bidir), GPP_D_18_GSPI3_MISO_THC1_SPI2_IO_0 (bidir), GPP_D_19_GSPI3_MOSI_THC1_SPI2_IO_1 (bidir), GPP_D_20_UART3_RXD_THC1_SPI2_IO_2 (bidir), GPP_D_21_UART3_TXD_THC1_SPI2_IO_3 (bidir), GPP_D_22_UART3_RTSB_THC1_SPI2_RST_N (bidir), GPP_D_23_UART3_CTSB_THC1_SPI2_INT_N (bidir), GPP_E_0_SATAXPCIE_0_SATAGP_0 (bidir), GPP_E_1_SATAXPCIE_1_SATAGP_1 (bidir), GPP_E_2_SATAXPCIE_2_SATAGP_2 (bidir), GPP_E_3_CPU_GP_0 (bidir), GPP_E_4_SATA_DEVSLP_0 (bidir), GPP_E_5_SATA_DEVSLP_1 (bidir), GPP_E_6_SATA_DEVSLP_2 (bidir), GPP_E_7_CPU_GP_1 (bidir), GPP_E_8_SATA_LEDB_SPI1_CS1_N (bidir), GPP_E_9_USB2_OCB_0 (bidir), GPP_E_10_USB2_OCB_1 (bidir), GPP_E_11_USB2_OCB_2_GMII_MDC_1 (bidir), GPP_E_12_USB2_OCB_3_GMII_MDIO_1 (bidir), GPP_E_13_SPI1_CSB_THC0_SPI1_CS_N (bidir), GPP_E_14_SPI1_CLK_THC0_SPI1_CLK (bidir), GPP_E_15_SPI1_MISO_IO_1_THC0_SPI1_IO_1 (bidir), GPP_E_16_SPI1_MOSI_IO_0_THC0_SPI1_IO_0 (bidir), GPP_E_17_SPI1_IO_2_THC0_SPI1_IO_2 (bidir), GPP_E_18_SPI1_IO_3_THC0_SPI1_IO_3 (bidir), GPP_E_19_THC0_SPI1_RST_N (bidir), GPP_E_20_THC0_SPI1_INT_N (bidir), GPP_E_21_ISH_UART0_CTSB_SML0BALERT_N (bidir)

### Nets
CNV_RF_RST_1P8_N: U23601.AK4(GPP_D5/CNV_RF_RESET#) ; port CNV_RF_RST_1P8_N
CNVI_CLKREQ_1P8_N: U23601.AJ2(GPP_D6/MODEM_CLKREQ) ; port CNVI_CLKREQ_1P8_N
GPP_C_0_SMBCLK: U23601.AE53(GPP_C0/SMBCLK) ; port GPP_C_0_SMBCLK
GPP_C_1_SMBDATA: U23601.AE54(GPP_C1/SMBDATA) ; port GPP_C_1_SMBDATA
GPP_C_2_SMBALERT_N: U23601.AD53(GPP_C2/SMBALERT#) ; port GPP_C_2_SMBALERT_N
GPP_C_3_ISH_UART0_RXD_SML0BDATA_I2C2_SDA: U23601.Y43(GPP_C3/ISH_UART0_RXD/I2C2_SDA) ; port GPP_C_3_ISH_UART0_RXD_SML0BDATA_I2C2_SDA
GPP_C_4_ISH_UART0_TXD_SML0BCLK_I2C2_SCL: U23601.AB43(GPP_C4/ISH_UART0_TXD/I2C2_SCL) ; port GPP_C_4_ISH_UART0_TXD_SML0BCLK_I2C2_SCL
GPP_C_5_SML0ALERT_N: U23601.AB41(GPP_C5/SML0ALERT#) ; port GPP_C_5_SML0ALERT_N
GPP_C_6_ISH_I2C2_SDA_I2C3_SDA: U23601.AD47(GPP_C6/ISH_I2C2_SDA/I2C3_SDA) ; port GPP_C_6_ISH_I2C2_SDA_I2C3_SDA
GPP_C_7_ISH_I2C2_SCL_I2C3_SCL: U23601.AD45(GPP_C7/ISH_I2C2_SCL/I2C3_SCL) ; port GPP_C_7_ISH_I2C2_SCL_I2C3_SCL
GPP_C_8_UART0_RXD: U23601.AF48(GPP_C8/UART0_RXD) ; port GPP_C_8_UART0_RXD
GPP_C_9_UART0_TXD: U23601.AF52(GPP_C9/UART0_TXD) ; port GPP_C_9_UART0_TXD
GPP_C_11_UART0_CTS_N: U23601.AD52(GPP_C11/UART0_CTS#) ; port GPP_C_11_UART0_CTS_N
GPP_C_12_UART1_RXD_ISH_UART1_RXD: U23601.AJ52(GPP_C12/UART1_RXD/ISH_UART1_RXD) ; port GPP_C_12_UART1_RXD_ISH_UART1_RXD
GPP_C_13_UART1_TXD_ISH_UART1_TXD: U23601.AF45(GPP_C13/UART1_TXD/ISH_UART1_TXD) ; port GPP_C_13_UART1_TXD_ISH_UART1_TXD
GPP_C_14_UART1_RTSB_ISH_UART1_RTS_N: U23601.AF53(GPP_C14/UART1_RTS#/ISH_UART1_RTS#) ; port GPP_C_14_UART1_RTSB_ISH_UART1_RTS_N
GPP_C_16_I2C0_SDA: U23601.AJ54(GPP_C16/I2C0_SDA) ; port GPP_C_16_I2C0_SDA
GPP_C_17_I2C0_SCL: U23601.AJ53(GPP_C17/I2C0_SCL) ; port GPP_C_17_I2C0_SCL
GPP_C_20_UART2_RXD_CNV_MFUART0_RXD: U23601.AF50(GPP_C20/UART2_RXD) ; port GPP_C_20_UART2_RXD_CNV_MFUART0_RXD
GPP_C_21_UART2_TXD_CNV_MFUART0_TXD: U23601.AG52(GPP_C21/UART2_TXD) ; port GPP_C_21_UART2_TXD_CNV_MFUART0_TXD
GPP_C_22_UART2_RTSB_CNV_MFUART0_RTS_N: U23601.AH51(GPP_C22/UART2_RTS#) ; port GPP_C_22_UART2_RTSB_CNV_MFUART0_RTS_N
GPP_C_23_UART2_CTSB_CNV_MFUART0_CTS_N: U23601.AH43(GPP_C23/UART2_CTS#) ; port GPP_C_23_UART2_CTSB_CNV_MFUART0_CTS_N
GPP_D_4_SML1CLK: U23601.AL4(GPP_D4/SML1CLK) ; port GPP_D_4_SML1CLK
GPP_D_9_SML0CLK: U23601.AM13(GPP_D9/SML0CLK) ; port GPP_D_9_SML0CLK
GPP_D_10_SML0DATA: U23601.AM15(GPP_D10/SML0DATA) ; port GPP_D_10_SML0DATA
GPP_D_15_SML1DATA: U23601.AK3(GPP_D15/SML1DATA) ; port GPP_D_15_SML1DATA
GPP_D_16_GSPI3_CS0B_THC1_SPI2_CS_N: U23601.AF11(GPP_D16/GSPI3_CS0#) ; port GPP_D_16_GSPI3_CS0B_THC1_SPI2_CS_N
GPP_D_17_GSPI3_CLK_THC1_SPI2_CLK: U23601.AH13(GPP_D17/GSPI3_CLK) ; port GPP_D_17_GSPI3_CLK_THC1_SPI2_CLK
GPP_D_18_GSPI3_MISO_THC1_SPI2_IO_0: U23601.AK15(GPP_D18/GSPI3_MISO) ; port GPP_D_18_GSPI3_MISO_THC1_SPI2_IO_0
GPP_D_19_GSPI3_MOSI_THC1_SPI2_IO_1: U23601.AF9(GPP_D19/GSPI3_MOSI) ; port GPP_D_19_GSPI3_MOSI_THC1_SPI2_IO_1
GPP_D_20_UART3_RXD_THC1_SPI2_IO_2: U23601.AM3(GPP_D20/UART3_RXD) ; port GPP_D_20_UART3_RXD_THC1_SPI2_IO_2
GPP_D_21_UART3_TXD_THC1_SPI2_IO_3: U23601.AH5(GPP_D21/UART3_TXD) ; port GPP_D_21_UART3_TXD_THC1_SPI2_IO_3
GPP_D_22_UART3_RTSB_THC1_SPI2_RST_N: U23601.AM4(GPP_D22/UART3_RTS#) ; port GPP_D_22_UART3_RTSB_THC1_SPI2_RST_N
GPP_D_23_UART3_CTSB_THC1_SPI2_INT_N: U23601.AJ11(GPP_D23/UART3_CTS#) ; port GPP_D_23_UART3_CTSB_THC1_SPI2_INT_N
GPP_E_0_SATAXPCIE_0_SATAGP_0: U23601.BB53(GPP_E0/SATAXPCIE0/SATAGP0) ; port GPP_E_0_SATAXPCIE_0_SATAGP_0
GPP_E_1_SATAXPCIE_1_SATAGP_1: U23601.BD44(GPP_E1/SATAXPCIE1/SATAGP1) ; port GPP_E_1_SATAXPCIE_1_SATAGP_1
GPP_E_2_SATAXPCIE_2_SATAGP_2: U23601.AY40(GPP_E2/SATAXPCIE2/SATAGP2) ; port GPP_E_2_SATAXPCIE_2_SATAGP_2
GPP_E_3_CPU_GP_0: U23601.BB43(GPP_E3/CPU_GP0) ; port GPP_E_3_CPU_GP_0
GPP_E_4_SATA_DEVSLP_0: U23601.BD52(GPP_E4/SATA_DEVSLP0) ; port GPP_E_4_SATA_DEVSLP_0
GPP_E_5_SATA_DEVSLP_1: U23601.BA47(GPP_E5/SATA_DEVSLP1) ; port GPP_E_5_SATA_DEVSLP_1
GPP_E_6_SATA_DEVSLP_2: U23601.BC52(GPP_E6/SATA_DEVSLP2) ; port GPP_E_6_SATA_DEVSLP_2
GPP_E_7_CPU_GP_1: U23601.BD53(GPP_E7/CPU_GP1) ; port GPP_E_7_CPU_GP_1
GPP_E_8_SATA_LEDB_SPI1_CS1_N: U23601.BJ51(GPP_E8/SATALED#/SPI1_CS1#) ; port GPP_E_8_SATA_LEDB_SPI1_CS1_N
GPP_E_9_USB2_OCB_0: U23601.BA40(GPP_E9/USB_OC0#) ; port GPP_E_9_USB2_OCB_0
GPP_E_10_USB2_OCB_1: U23601.BA43(GPP_E10/USB_OC1#) ; port GPP_E_10_USB2_OCB_1
GPP_E_11_USB2_OCB_2_GMII_MDC_1: U23601.BG51(GPP_E11/USB_OC2#) ; port GPP_E_11_USB2_OCB_2_GMII_MDC_1
GPP_E_12_USB2_OCB_3_GMII_MDIO_1: U23601.BC47(GPP_E12/USB_OC3#) ; port GPP_E_12_USB2_OCB_3_GMII_MDIO_1
GPP_E_13_SPI1_CSB_THC0_SPI1_CS_N: U23601.BG49(GPP_E13/SBK0/BK0) ; port GPP_E_13_SPI1_CSB_THC0_SPI1_CS_N
GPP_E_14_SPI1_CLK_THC0_SPI1_CLK: U23601.BH50(GPP_E14/SBK1/BK1) ; port GPP_E_14_SPI1_CLK_THC0_SPI1_CLK
GPP_E_15_SPI1_MISO_IO_1_THC0_SPI1_IO_1: U23601.BF49(GPP_E15/SBK2/BK2) ; port GPP_E_15_SPI1_MISO_IO_1_THC0_SPI1_IO_1
GPP_E_16_SPI1_MOSI_IO_0_THC0_SPI1_IO_0: U23601.BH49(GPP_E16/SBK3/BK3) ; port GPP_E_16_SPI1_MOSI_IO_0_THC0_SPI1_IO_0
GPP_E_17_SPI1_IO_2_THC0_SPI1_IO_2: U23601.BG48(GPP_E17) ; port GPP_E_17_SPI1_IO_2_THC0_SPI1_IO_2
GPP_E_18_SPI1_IO_3_THC0_SPI1_IO_3: U23601.BE49(GPP_E18) ; port GPP_E_18_SPI1_IO_3_THC0_SPI1_IO_3
GPP_E_19_THC0_SPI1_RST_N: U23601.BF52(GPP_E19) ; port GPP_E_19_THC0_SPI1_RST_N
GPP_E_20_THC0_SPI1_INT_N: U23601.BE50(GPP_E20) ; port GPP_E_20_THC0_SPI1_INT_N
GPP_E_21_ISH_UART0_CTSB_SML0BALERT_N: U23601.BC51(GPP_E21/ISH_UART0_CTS#) ; port GPP_E_21_ISH_UART0_CTSB_SML0BALERT_N
TP_GPP_D7: U23601.AJ4(GPP_D7)
TP_GPP_D8: U23601.AJ3(GPP_D8)

Not connected (* = marked no-connect by the designer): U23601 AD48(GPP_C18/I2C1_SDA)* AD50(GPP_C19/I2C1_SCL)* AF47(GPP_C10/UART0_RTS#)* AG53(GPP_C15/UART1_CTS#/ISH_UART1_CTS#)*

### Notes on the sheet
- GPP C_D_E
- (in symbol C_RPL_S_PCH_EXT, part K) 11 OF 14

### Library data of the parts
U23601 = C_RPL_S_PCH_EXT: Manufacturer Part Number: *; Case/Package: *